# EasyEDA Pro project ProPrj_3x3motors_d_2025-05-30.epro, board PCB1
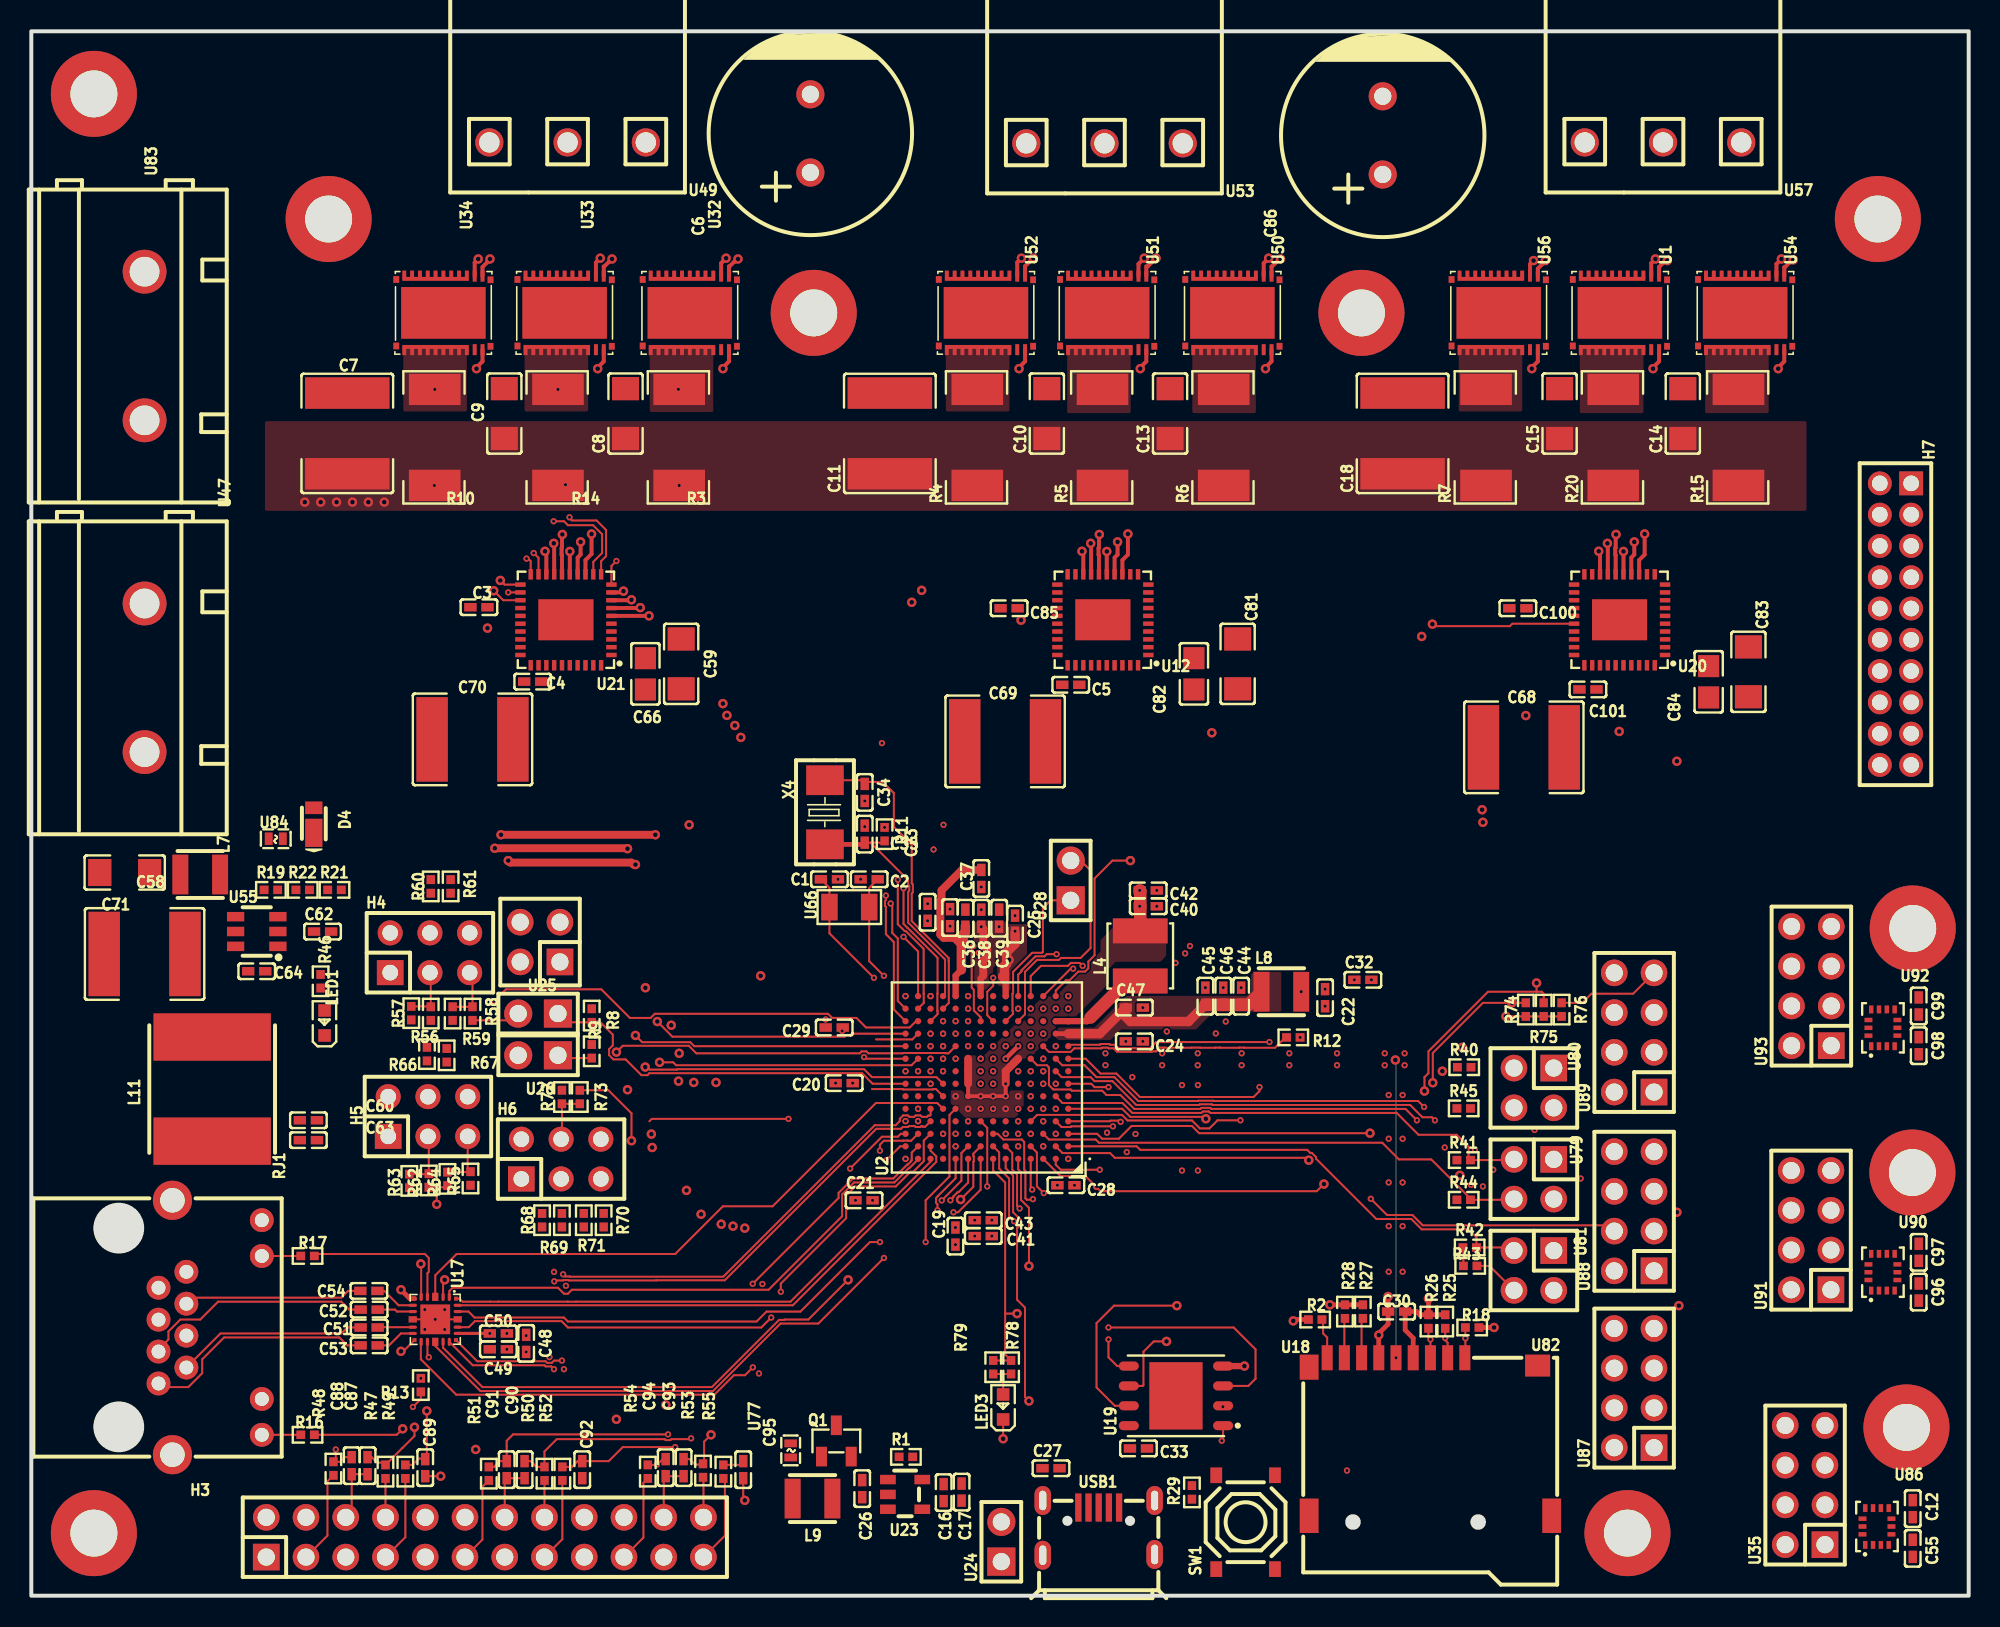
[diagram p4: board, top side]
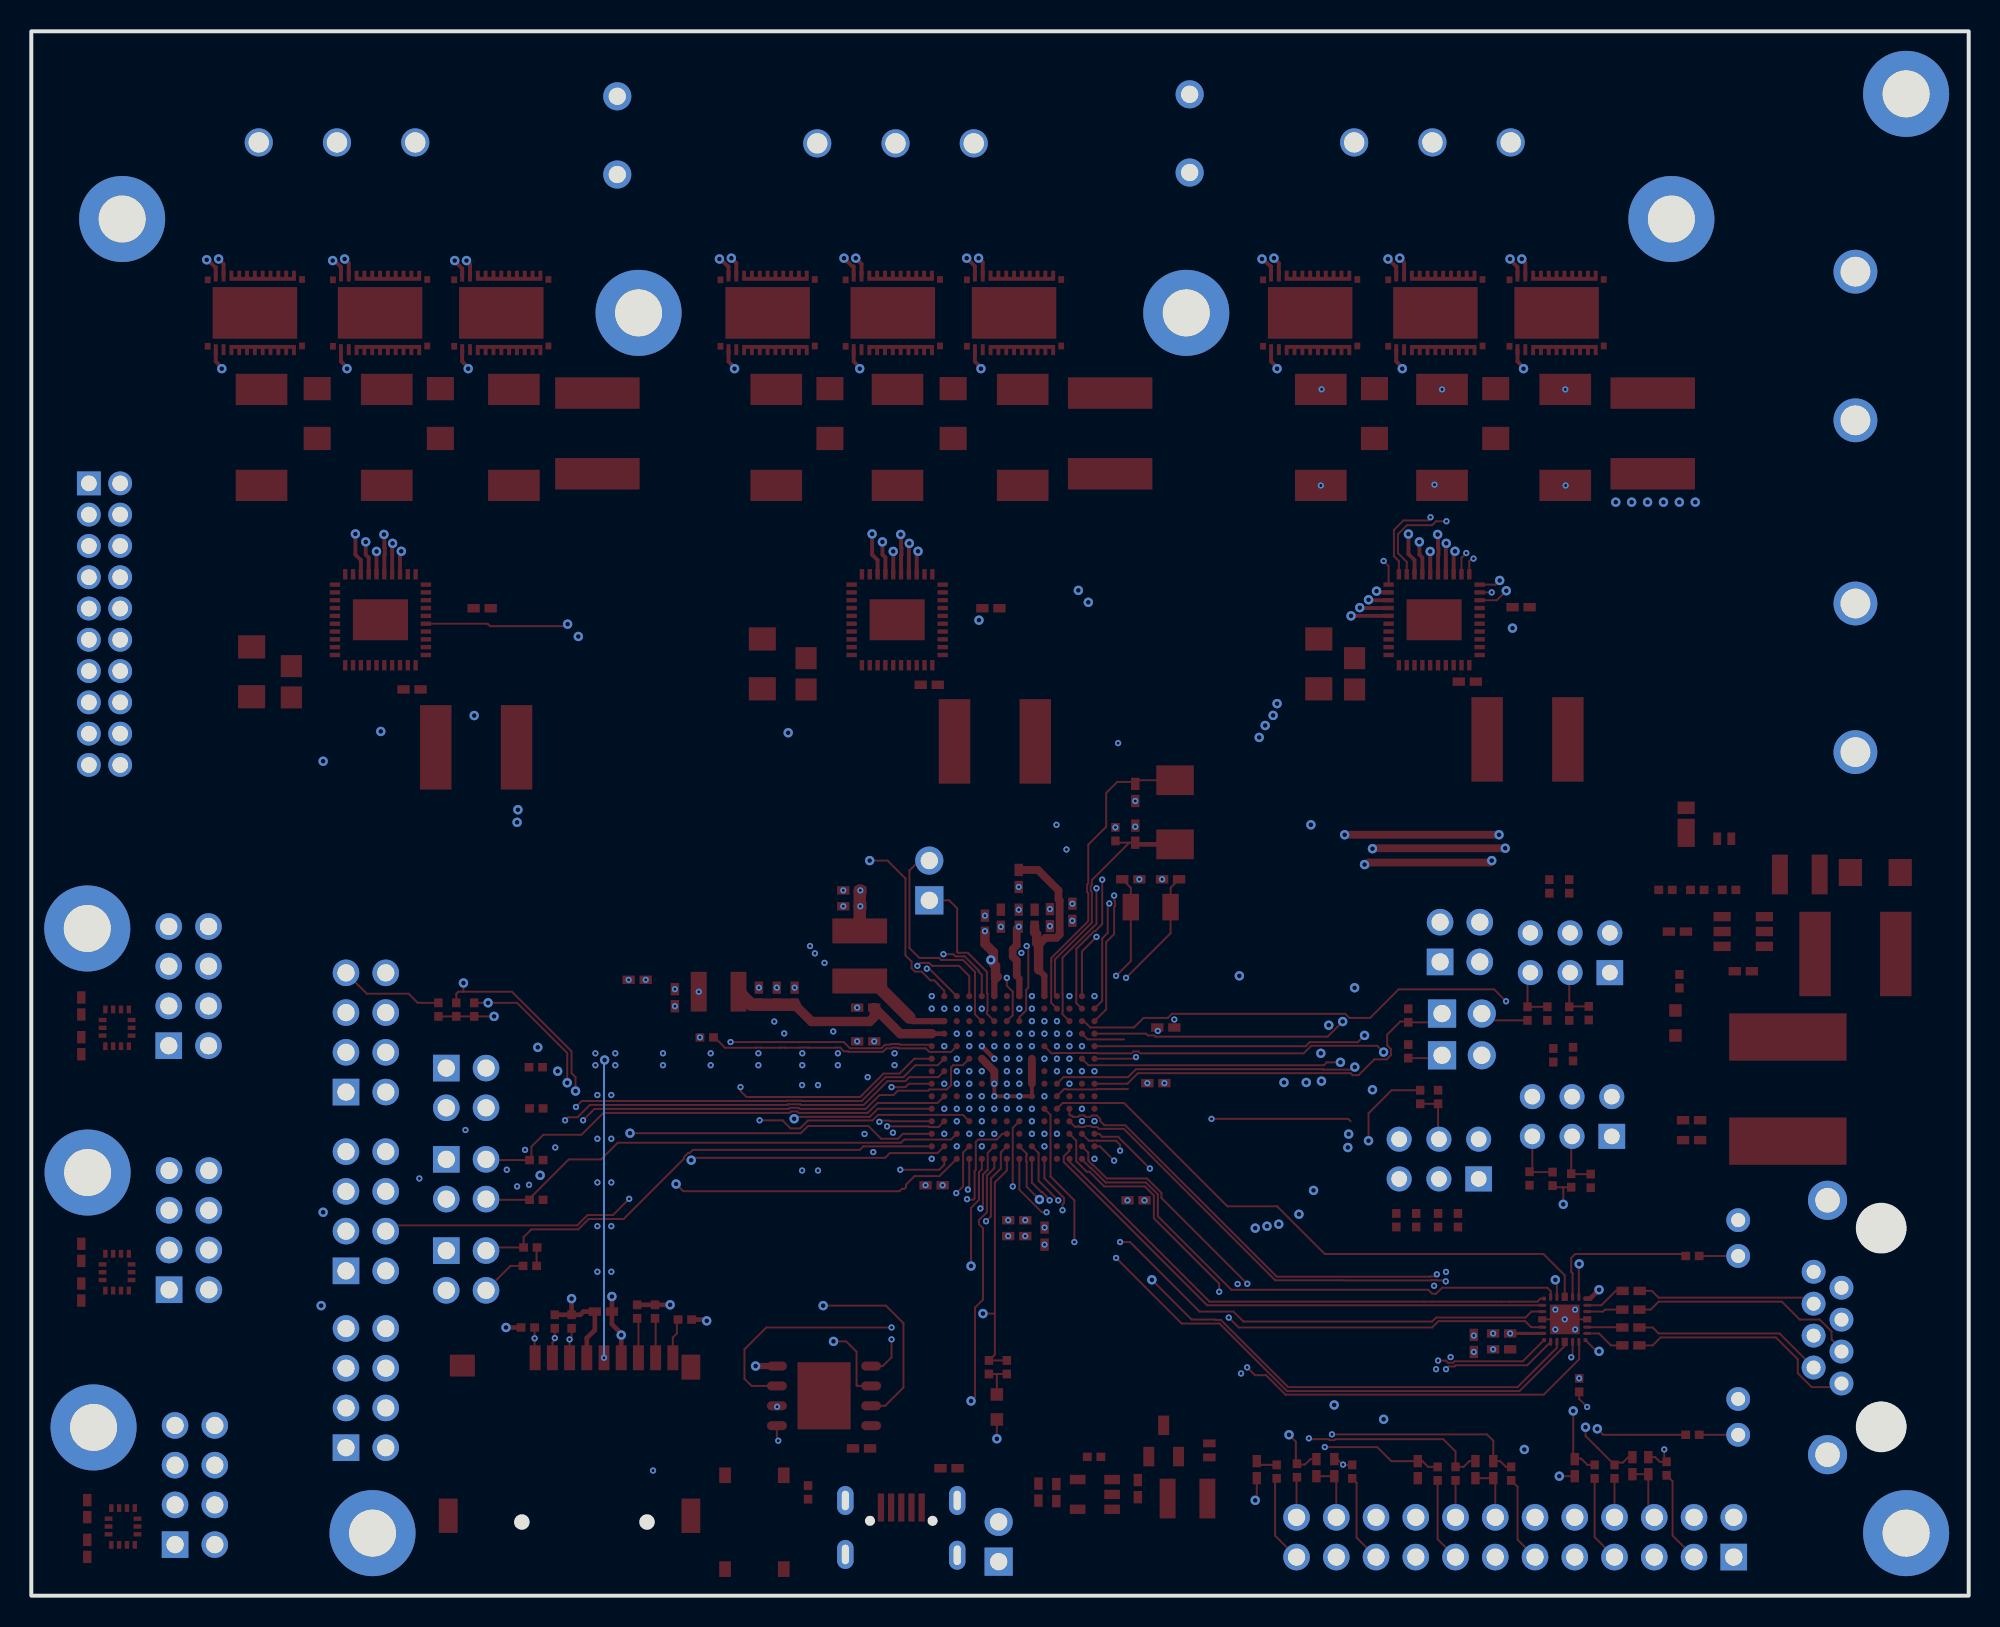
[diagram p5: board, bottom side, seen from below]

Outline 123.81 x 100 mm; copper layers: Top Layer, Inner1, Inner2, Inner3, Inner4, Bottom Layer. Coordinates in mm from the lower left corner of the outline.
Outline path: rectangle 0,100 123.81,0
Stack: Top Layer 0.035mm Outer layer thickness 1oz / Dielectric1 0.0994mm 3313 RC57% 4.2mil / Inner1 0.0152mm Inner layer thickness / Dielectric2 0.55mm 0.55mm H/H No copper / Inner2 0.0152mm Inner layer thickness / Dielectric3 0.1088mm 2116 RC54% 4.9mil / Inner3 0.0152mm Inner layer thickness / Dielectric4 0.55mm 0.55mm H/H No copper / Inner4 0.0152mm Inner layer thickness / Dielectric5 0.0994mm 3313 RC57% 4.2mil / Bottom Layer 0.035mm Outer layer thickness 1oz

## Design rules (mm)
template: Custom Config
spacing copperThickness1oz (default): track to track 0.102, other pairs 0.102 to 0.3
spacing copperThickness2oz: track to track 0.203, other pairs 0.152 to 0.3
track width copperThickness1oz (default): min 0.127, default 0.127, max 2.54
track width copperThickness2oz: min 0.203, default 0.254, max 2.54
differential pair differentialPair (default): width min 0.127, default 0.254, max 2.54; gap min 0.152, default 0.152
via viaSize (default): diameter min 0.4, default 0.6, max 10; hole min 0.2, default 0.3, max 6.3

## Placement (name value [footprint] x y rotation side)
C1  12pF  [C0402]  51 45.79 0 top
C2  12pF  [C0402]  53.54 45.79 180 top
C3  100nF  [C0402]  28.61 63.19 180 top
C4  4.7uF  [C0402]  32.04 58.43 180 top
C5  4.7uF  [C0402]  66.42 58.23 180 top
C6  1000uF  [CAP-TH_BD13.0-P5.00-D0.6-FD]  49.78 93.47 90 top
C7  22uF  [C2220]  20.19 74.3 90 top
C8  1uF  [C1206]  37.97 75.56 90 top
C9  1uF  [C1206]  30.23 75.56 90 top
C10  1uF  [C1206]  64.9 75.56 90 top
C11  22uF  [C2220]  54.86 74.3 90 top
C12  4.7uF  [C0402]  120.23 5.57 90 top
C13  1uF  [C1206]  72.77 75.56 90 top
C14  1uF  [C1206]  105.54 75.56 90 top
C15  1uF  [C1206]  97.66 75.56 90 top
C16  4.7uF  [C0402]  58.3 6.59 90 top
C17  4.7uF  [C0402]  59.45 6.62 90 top
C18  22uF  [C2220]  87.63 74.3 90 top
C19  100nF  [C0402]  59.06 22.99 90 top
C20  100nF  [C0402]  51.94 32.77 0 top
C21  100nF  [C0402]  53.21 25.27 0 top
C22  100nF  [C0402]  82.68 38.23 90 top
C23  100nF  [C0402]  57.28 43.69 270 top
C24  100nF  [C0402]  70.49 35.43 180 top
C25  100nF  [C0402]  62.87 42.93 270 top
C26  100nF  [C0402]  53.1 6.84 90 top
C27  4.7uF  [C0402]  65.16 8.15 0 top
C28  100nF  [C0402]  66.12 26.24 180 top
C29  4.7uF  [C0402]  51.31 36.32 0 top
C30  100nF  [C0402]  87.25 18.16 180 top
C31  100nF  [C0402]  58.71 43.34 270 top
C32  100nF  [C0402]  85.09 39.37 0 top
C33  100nF  [C0402]  70.75 9.42 0 top
C34  12pF  [C0402]  53.26 51.35 270 top
C35  12pF  [C0402]  53.26 48.68 90 top
C36  4.7uF  [C0402]  59.69 43.31 270 top
C37  100nF  [C0402]  60.71 45.85 90 top
C38  4.7uF  [C0402]  60.71 43.31 270 top
C39  100nF  [C0402]  61.85 43.31 270 top
C40  4.7uF  [C0402]  71.37 44.07 0 top
C41  4.7uF  [C0402]  60.83 22.99 0 top
C42  4.7uF  [C0402]  71.37 45.08 0 top
C43  100nF  [C0402]  60.83 24 0 top
C44  4.7uF  [C0402]  77.31 38.32 90 top
C45  4.7uF  [C0402]  75.03 38.32 90 top
C46  4.7uF  [C0402]  76.17 38.32 90 top
C47  100nF  [C0402]  70.49 37.59 0 top
C48  4.7uF  [C0402]  31.62 16.13 90 top
C49  4.7uF  [C0402]  29.84 15.75 0 top
C50  100nF  [C0402]  29.84 16.76 0 top
C51  33nF  [C0402]  21.59 17.15 0 top
C52  33nF  [C0402]  21.59 18.29 0 top
C53  33nF  [C0402]  21.59 16 0 top
C54  33nF  [C0402]  21.57 19.48 0 top
C55  100nF  [C0402]  120.23 3.03 270 top
C58  1uF  [C1206]  5.97 46.23 0 top
C59  1uF  [C1206]  41.53 59.56 90 top
C60  4.7uF  [C0402]  17.71 30.39 0 top
C62  4.7uF  [C0402]  18.61 42.45 0 top
C63  4.7uF  [C0402]  17.71 29.12 0 top
C64  100nF  [C0402]  14.41 39.92 0 top
C66  22nF  [C0805]  39.24 58.93 90 top
C68  22uF  [C2220]  95.38 54.23 180 top
C69  22uF  [C2220]  62.23 54.61 180 top
C70  22uF  [C2220]  28.19 54.74 180 top
C71  22uF  [C2220]  7.24 41.02 0 top
C81  1uF  [C1206]  77.09 59.56 270 top
C82  22nF  [C0805]  74.29 58.93 90 top
C83  1uF  [C1206]  109.73 59.06 270 top
C84  22nF  [C0805]  107.19 58.42 90 top
C85  100nF  [C0402]  62.48 63.12 180 top
C86  1000uF  [CAP-TH_BD13.0-P5.00-D0.6-FD]  86.36 93.34 90 top
C87  4.7nF  [C0402]  21.49 8.31 270 top
C88  4.7nF  [C0402]  20.47 8.31 270 top
C89  4.7nF  [C0402]  25.17 8.18 270 top
C90  4.7nF  [C0402]  31.52 8.06 270 top
C91  4.7nF  [C0402]  30.38 8.06 270 top
C92  4.7nF  [C0402]  35.21 8.06 270 top
C93  4.7nF  [C0402]  41.68 8.18 270 top
C94  4.7nF  [C0402]  40.54 8.18 270 top
C95  4.7nF  [C0402]  45.49 8.06 270 top
C96  100nF  [C0402]  120.61 19.41 270 top
C97  4.7uF  [C0402]  120.61 21.95 90 top
C98  100nF  [C0402]  120.61 35.16 270 top
C99  4.7uF  [C0402]  120.61 37.7 90 top
C100  100nF  [C0402]  95 63.12 180 top
C101  4.7uF  [C0402]  99.47 57.93 180 top
D4  RB160VAM-60TR  [TUMD2M_L2.0-W1.4-LS2.5-RD]  18.05 49.56 90 top
H3  HX PZ2.54-2x12P ZZ  [HDR-TH_24P-P2.54-V-M-R2-C12-S2.54]  28.98 3.74 0 top
H4  排母/2.54mm2x3直排母袋装环保  [HDR-TH_6P-P2.54-V-F-R2-C3-S2.54]  25.47 41.1 0 top
H5  排母/2.54mm2x3直排母袋装环保  [HDR-TH_6P-P2.54-V-F-R2-C3-S2.54]  25.35 30.63 0 top
H6  排母/2.54mm2x3直排母袋装环保  [HDR-TH_6P-P2.54-V-F-R2-C3-S2.54]  33.86 27.91 0 top
H7  2.0-210-SMT-Pin  [HDR-TH_20P-P2.00-V-F-R2-C10-S2.00]  119.13 62.1 270 top
L4  4.7uH  [IND-SMD_L4.0-W4.0]  70.87 40.89 90 top
L7  120nH  [IND-SMD_L2.9-W2.5]  10.8 46.1 180 top
L8  120nH  [IND-SMD_L2.9-W2.5]  79.88 38.61 0 top
L9  120nH  [IND-SMD_L2.9-W2.5]  49.92 6.21 180 top
L11  33uH  [IND-SMD_L8.0-W8.0]  11.56 32.39 90 top
LED1  KT-0603R  [LED0603-RD]  18.74 36.61 90 top
LED3  KT-0603R  [LED0603-RD]  62.1 12.06 90 top
NOREF  -  [Pad_e32]  19 88 0 top
NOREF#2  -  [Pad_e238]  4 96 0 top
NOREF#3  -  [Pad_e94]  118 88 0 top
NOREF#4  -  [Pad_e323]  119.83 10.76 90 top
NOREF#5  -  [Pad_e39]  50 82 0 top
NOREF#6  -  [Pad_e93]  85 82 0 top
NOREF#7  -  [Pad_e242]  4 4 0 top
NOREF#8  -  [Pad_e320]  120.23 42.65 90 top
NOREF#9  -  [Pad_e321]  120.21 27.05 90 top
NOREF#10  -  [Pad_e240]  102 4 0 top
Q1  DMG2305UX-7  [SOT-23-3_L2.9-W1.3-P1.90-LS2.4-BR]  51.44 9.89 270 top
R1  100kΩ  [R0402]  55.89 8.88 0 top
R2  100kΩ  [R0402]  82.04 17.65 180 top
R3  20mΩ  [RES-SMD_L6.4-W3.2-R2512]  41.4 74.04 90 top
R4  20mΩ  [RES-SMD_L6.4-W3.2-R2512]  60.45 74.04 90 top
R5  20mΩ  [RES-SMD_L6.4-W3.2-R2512]  68.45 74.04 90 top
R6  20mΩ  [RES-SMD_L6.4-W3.2-R2512]  76.2 74.04 90 top
R7  20mΩ  [RES-SMD_L6.4-W3.2-R2512]  92.96 74.04 90 top
R8  47kΩ  [R0402]  35.81 37.08 90 top
R9  47kΩ  [R0402]  35.81 34.8 270 top
R10  20mΩ  [RES-SMD_L6.4-W3.2-R2512]  25.78 74.04 90 top
R11  2.2MΩ  [R0402]  54.53 48.68 90 top
R12  1kΩ  [R0402]  80.65 35.69 180 top
R13  6.49kΩ  [R0402]  24.89 13.46 90 top
R14  20mΩ  [RES-SMD_L6.4-W3.2-R2512]  33.66 74.04 90 top
R15  20mΩ  [RES-SMD_L6.4-W3.2-R2512]  109.09 74.04 90 top
R16  150Ω  [R0402]  17.65 10.29 0 top
R17  150Ω  [R0402]  17.65 21.72 0 top
R18  47kΩ  [R0402]  92.07 17.15 0 top
R19  20kΩ  [R0402]  15.31 45.12 0 top
R20  20mΩ  [RES-SMD_L6.4-W3.2-R2512]  101.09 74.04 90 top
R21  100kΩ  [R0402]  19.38 45.12 0 top
R22  4.7kΩ  [R0402]  17.34 45.12 0 top
R25  47kΩ  [R0402]  90.35 17.53 90 top
R26  47kΩ  [R0402]  89.28 17.53 90 top
R27  47kΩ  [R0402]  85.09 18.16 90 top
R28  47kΩ  [R0402]  83.95 18.16 90 top
R29  47kΩ  [R0402]  74.17 6.6 90 top
R40  1kΩ  [R0402]  91.57 33.78 0 top
R41  1kΩ  [R0402]  91.53 27.85 0 top
R42  1kΩ  [R0402]  91.91 22.26 0 top
R43  1kΩ  [R0402]  91.95 21.08 0 top
R44  1kΩ  [R0402]  91.53 25.31 0 top
R45  1kΩ  [R0402]  91.53 31.15 0 top
R46  1kΩ  [R0402]  18.49 39.28 270 top
R47  4.7kΩ  [R0402]  22.63 7.93 270 top
R48  4.7kΩ  [R0402]  19.3 8.13 270 top
R49  4.7kΩ  [R0402]  23.9 7.93 270 top
R50  4.7kΩ  [R0402]  32.79 7.8 270 top
R51  4.7kΩ  [R0402]  29.24 7.8 270 top
R52  4.7kΩ  [R0402]  33.94 7.8 270 top
R53  4.7kΩ  [R0402]  42.93 8 270 top
R54  4.7kΩ  [R0402]  39.4 7.93 270 top
R55  4.7kΩ  [R0402]  44.22 7.93 270 top
R56  4.7kΩ  [R0402]  25.53 37.21 270 top
R57  1kΩ  [R0402]  24.28 37.24 90 top
R58  4.7kΩ  [R0402]  28.19 37.21 270 top
R59  1kΩ  [R0402]  26.92 37.21 90 top
R60  4.7kΩ  [R0402]  25.53 45.34 90 top
R61  1kΩ  [R0402]  26.8 45.34 270 top
R62  4.7kΩ  [R0402]  25.4 26.54 270 top
R63  1kΩ  [R0402]  24.16 26.52 90 top
R64  4.7kΩ  [R0402]  26.59 26.65 270 top
R65  1kΩ  [R0402]  28.07 26.67 90 top
R66  4.7kΩ  [R0402]  25.28 34.62 90 top
R67  1kΩ  [R0402]  26.54 34.54 270 top
R68  4.7kΩ  [R0402]  32.64 24 270 top
R69  1kΩ  [R0402]  33.91 24 90 top
R70  4.7kΩ  [R0402]  36.58 24 270 top
R71  1kΩ  [R0402]  35.31 24 90 top
R72  4.7kΩ  [R0402]  33.91 31.88 90 top
R73  1kΩ  [R0402]  35.05 31.88 270 top
R74  4.7kΩ  [R0402]  95.5 37.47 90 top
R75  4.7kΩ  [R0402]  96.65 37.47 90 top
R76  4.7kΩ  [R0402]  97.79 37.47 90 top
R78  1kΩ  [R0402]  62.61 14.6 270 top
R79  1kΩ  [R0402]  61.47 14.6 270 top
RJ1  RJHSE5384  [RJ45-TH_RJHSE5384]  11.43 17.15 270 top
SW1  TS-1187A-B-A-B  [SW-SMD_4P-L5.1-W5.1-P3.70-LS6.5-TL_H1.5]  77.6 4.7 90 top
U1  CSD88599Q5DC  [SON-22_L5.0-W6.0-P0.50-CSD88599Q5DCT]  101.52 82 270 top
U2  MIMXRT1062DVJ6B  [LFBGA-196_L12.0-W12.0-R14-C14-P0.80-BL]  61.06 33.13 90 top
U12  DRV8304SRHAR  [VQFN-40_L6.0-W6.0-P0.50-TL-EP]  68.47 62.38 180 top
U17  DP83825IRMQR  [HVQFN-24_L3.0-W3.0-P0.40-TL-EP1.9]  25.81 17.66 270 top
U18  A-MicroTF-1.85A  [TF-SMD_A-MICROTF-1.85A]  89.41 10.16 0 top
U19  W25Q64JVZPIQ  [WSON-8_L6.0-W5.0-P1.27-BL-EP]  73.15 12.78 90 top
U20  DRV8304SRHAR  [VQFN-40_L6.0-W6.0-P0.50-TL-EP]  101.5 62.38 180 top
U21  DRV8304SRHAR  [VQFN-40_L6.0-W6.0-P0.50-TL-EP]  34.16 62.38 180 top
U23  TLV75733PDBVR  [SOT-23-5_L2.9-W1.6-P0.95-LS2.8-BL]  55.84 6.47 270 top
U24  USB-5V-supply  [HDR-TH_2P-P2.54-V-M-1]  61.99 3.45 90 top
U25  BOOT_MODE0  [HDR-TH_2P-P2.54-V-M-1]  32.39 37.21 180 top
U26  BOOT_MODE1  [HDR-TH_2P-P2.54-V-M-1]  32.39 34.54 180 top
U28  Spare  [HDR-TH_2P-P2.54-V-M-1]  66.42 45.72 90 top
U32  CSD88599Q5DC  [SON-22_L5.0-W6.0-P0.50-CSD88599Q5DCT]  42.08 82 270 top
U33  CSD88599Q5DC  [SON-22_L5.0-W6.0-P0.50-CSD88599Q5DCT]  34.08 82 270 top
U34  CSD88599Q5DC  [SON-22_L5.0-W6.0-P0.50-CSD88599Q5DCT]  26.33 82 270 top
U35  PZ2.54-2*4  [HDR-TH_8P-P2.54-V-M-R2-C4-S2.54]  113.35 7.07 90 top
U47  MX950T-9.5-02P-GN01-Cu-PS-A  [CONN-TH_2P-P9.50_DB910-9.52-2P]  7.24 58.67 270 top
U49  KF332K-5.0-3P  [CONN-TH_KF332K-5.0-3P]  34.27 92.9 180 top
U50  CSD88599Q5DC  [SON-22_L5.0-W6.0-P0.50-CSD88599Q5DCT]  76.75 82 270 top
U51  CSD88599Q5DC  [SON-22_L5.0-W6.0-P0.50-CSD88599Q5DCT]  68.75 82 270 top
U52  CSD88599Q5DC  [SON-22_L5.0-W6.0-P0.50-CSD88599Q5DCT]  61 82 270 top
U53  KF332K-5.0-3P  [CONN-TH_KF332K-5.0-3P]  68.58 92.84 180 top
U54  CSD88599Q5DC  [SON-22_L5.0-W6.0-P0.50-CSD88599Q5DCT]  109.52 82 270 top
U55  LMR51606XDBVR  [SOT-23-6_L2.9-W1.6-P0.95-LS2.8-BR]  14.41 42.46 0 top
U56  CSD88599Q5DC  [SON-22_L5.0-W6.0-P0.50-CSD88599Q5DCT]  93.77 82 270 top
U57  KF332K-5.0-3P  [CONN-TH_KF332K-5.0-3P]  104.27 92.9 180 top
U66  32.768kHz  [CRYSTAL-SMD_L3.2-W1.5-2]  52.27 44.02 0 top
U77  0ABA-0500-TN  [F0402]  48.53 9.29 270 top
U79  PZ2.54-2*2  [HDR-TH_4P-P2.54-V-M-R2-C2-S2.54]  96.02 26.62 180 top
U80  PZ2.54-2*2  [HDR-TH_4P-P2.54-V-M-R2-C2-S2.54]  96.02 32.46 180 top
U81  PZ2.54-2*2  [HDR-TH_4P-P2.54-V-M-R2-C2-S2.54]  96.02 20.79 180 top
U82  PZ2.54-2*2  [HDR-TH_4P-P2.54-V-M-R2-C2-S2.54]  32.51 41.78 90 top
U83  MX950T-9.5-02P-GN01-Cu-PS-A  [CONN-TH_2P-P9.50_DB910-9.52-2P]  7.24 79.88 270 top
U84  0ABA-0500-TN  [F0402]  15.62 48.39 180 top
U86  ASM330LHHTR  [LGA-14L_L3.0-W2.5-P0.50-TL]  117.94 4.42 90 top
U87  PZ2.54-2*4  [HDR-TH_8P-P2.54-V-M-R2-C4-S2.54]  102.43 13.27 90 top
U88  PZ2.54-2*4  [HDR-TH_8P-P2.54-V-M-R2-C4-S2.54]  102.43 24.57 90 top
U89  PZ2.54-2*4  [HDR-TH_8P-P2.54-V-M-R2-C4-S2.54]  102.43 36 90 top
U90  ASM330LHHTR  [LGA-14L_L3.0-W2.5-P0.50-TL]  118.32 20.68 90 top
U91  PZ2.54-2*4  [HDR-TH_8P-P2.54-V-M-R2-C4-S2.54]  113.73 23.37 90 top
U92  ASM330LHHTR  [LGA-14L_L3.0-W2.5-P0.50-TL]  118.32 36.3 90 top
U93  PZ2.54-2*4  [HDR-TH_8P-P2.54-V-M-R2-C4-S2.54]  113.75 38.97 90 top
USB1  051N-4BH806-S  [MICRO-USB-SMD_051N-4BH806-S]  68.21 4.34 0 top
X4  24MHz  [OSC-SMD_L5.0-W3.2]  50.72 50.08 270 top

## Footprints (pads in the part's own frame, mm; a bottom-side part is the same pattern mirrored in y, then rotated)
C0402
  rect 0.79x0.54 smd: 1(-0.545,0) 2(0.545,0)
C0805
  rect 1.41x1.35 smd: 1(-1,0) 2(1,0)
C1206
  rect 1.485x1.728 smd: 1(-1.593,0) 2(1.593,0)
C2220
  rect 2.01x5.4 smd: 1(-2.58,0) 2(2.58,0)
CAP-TH_BD13.0-P5.00-D0.6-FD
  round 1.8 hole 1.1: 1(-2.5,0) 2(2.5,0)
CONN-TH_2P-P9.50_DB910-9.52-2P
  round 2.8 hole 1.9: 1(-4.75,0) 2(4.75,0)
CONN-TH_KF332K-5.0-3P
  round 1.8 hole 1.3: 1(-5,0) 2(0,0) 3(5,0)
CRYSTAL-SMD_L3.2-W1.5-2
  rect 1.05x1.7 smd: 1(-1.27,0) 2(1.27,0)
F0402
  rect 0.5x0.8 smd: 1(-0.45,0) 2(0.45,0)
HDR-TH_2P-P2.54-V-M-1
  rect 1.8x1.8 hole 1.1: 1(-1.27,0)
  round 1.8 hole 1.1: 2(1.27,0)
HDR-TH_4P-P2.54-V-M-R2-C2-S2.54
  rect 1.7x1.7 hole 1.1: 1(-1.27,-1.27)
  round 1.7 hole 1.1: 2(-1.27,1.27) 3(1.27,-1.27) 4(1.27,1.27)
HDR-TH_6P-P2.54-V-F-R2-C3-S2.54
  rect 1.7x1.6 hole 1: 1(-2.54,-1.27)
  round 1.6 hole 1: 2(-2.54,1.27) 3(0,-1.27) 4(0,1.27) 5(2.54,-1.27) 6(2.54,1.27)
HDR-TH_8P-P2.54-V-M-R2-C4-S2.54
  rect 1.7x1.7 hole 1.1: 1(-3.81,-1.27)
  round 1.7 hole 1.1: 2(-3.81,1.27) 3(-1.27,-1.27) 4(-1.27,1.27) 5(1.27,-1.27) 6(1.27,1.27) 7(3.81,-1.27) 8(3.81,1.27)
HDR-TH_20P-P2.00-V-F-R2-C10-S2.00
  rect 1.524x1.524 hole 1: 1(-9,1)
  round 1.524 hole 1: 2(-9,-1) 3(-7,1) 4(-7,-1) 5(-5,1) 6(-5,-1) 7(-3,1) 8(-3,-1) 9(-1,1) 10(-1,-1) 11(1,1) 12(1,-1) 13(3,1) 14(3,-1) 15(5,1) 16(5,-1) 17(7,1) 18(7,-1) 19(9,1) 20(9,-1)
HDR-TH_24P-P2.54-V-M-R2-C12-S2.54
  rect 1.7x1.7 hole 1.1: 1(-13.97,-1.27)
  round 1.7 hole 1.1: 2(-13.97,1.27) 3(-11.43,-1.27) 4(-11.43,1.27) 5(-8.89,-1.27) 6(-8.89,1.27) 7(-6.35,-1.27) 8(-6.35,1.27) 9(-3.81,-1.27) 10(-3.81,1.27) 11(-1.27,-1.27) 12(-1.27,1.27) 13(1.27,-1.27) 14(1.27,1.27) 15(3.81,-1.27) 16(3.81,1.27) 17(6.35,-1.27) 18(6.35,1.27) 19(8.89,-1.27) 20(8.89,1.27) 21(11.43,-1.27) 22(11.43,1.27) 23(13.97,-1.27) 24(13.97,1.27)
HVQFN-24_L3.0-W3.0-P0.40-TL-EP1.9
  oval 0.525x0.2 smd: 1(-1.438,0.9) 2(-1.438,0.5) 4(-1.438,-0.5) 5(-1.438,-0.9) 13(1.438,-0.9) 14(1.438,-0.5) 16(1.438,0.5) 17(1.438,0.9)
  rect 0.525x0.4 smd: 3(-1.438,0) 15(1.438,0)
  rect 0.25x0.25 smd: 6(-1.325,-1.325) 12(1.325,-1.325) 18(1.325,1.325) 24(-1.325,1.325)
  oval 0.2x0.525 smd: 7(-0.9,-1.438) 8(-0.5,-1.438) 10(0.5,-1.438) 11(0.9,-1.438) 19(0.9,1.438) 20(0.5,1.438) 22(-0.5,1.438) 23(-0.9,1.438)
  rect 0.4x0.525 smd: 9(0,-1.438) 21(0,1.438)
  rect 1.9x1.9 smd: 25(0,0)
IND-SMD_L2.9-W2.5
  rect 1.02x2.54 smd: 1(-1.27,0) 2(1.27,0)
IND-SMD_L4.0-W4.0
  rect 1.6x3.5 smd: 1(-1.6,0) 2(1.6,0)
IND-SMD_L8.0-W8.0
  rect 3.024x7.5 smd: 1(3.328,0) 2(-3.328,0)
LED0603-RD
  rect 0.8x0.8 smd: 1(-0.799,0) 2(0.799,0)
LFBGA-196_L12.0-W12.0-R14-C14-P0.80-BL
  round 0.4 smd: A1(-5.2,-5.2) A2(-5.2,-4.4) A3(-5.2,-3.6) A4(-5.2,-2.8) A5(-5.2,-2) A6(-5.2,-1.2) A7(-5.2,-0.4) A8(-5.2,0.4) A9(-5.2,1.2) A10(-5.2,2) A11(-5.2,2.8) A12(-5.2,3.6) A13(-5.2,4.4) A14(-5.2,5.2) B1(-4.4,-5.2) B2(-4.4,-4.4) B3(-4.4,-3.6) B4(-4.4,-2.8) B5(-4.4,-2) B6(-4.4,-1.2) B7(-4.4,-0.4) B8(-4.4,0.4) B9(-4.4,1.2) B10(-4.4,2) B11(-4.4,2.8) B12(-4.4,3.6) B13(-4.4,4.4) B14(-4.4,5.2) C1(-3.6,-5.2) C2(-3.6,-4.4) C3(-3.6,-3.6) C4(-3.6,-2.8) C5(-3.6,-2) C6(-3.6,-1.2) C7(-3.6,-0.4) C8(-3.6,0.4) C9(-3.6,1.2) C10(-3.6,2) C11(-3.6,2.8) C12(-3.6,3.6) C13(-3.6,4.4) C14(-3.6,5.2) D1(-2.8,-5.2) D2(-2.8,-4.4) D3(-2.8,-3.6) D4(-2.8,-2.8) D5(-2.8,-2) D6(-2.8,-1.2) D7(-2.8,-0.4) D8(-2.8,0.4) D9(-2.8,1.2) D10(-2.8,2) D11(-2.8,2.8) D12(-2.8,3.6) D13(-2.8,4.4) D14(-2.8,5.2) E1(-2,-5.2) E2(-2,-4.4) E3(-2,-3.6) E4(-2,-2.8) E5(-2,-2) E6(-2,-1.2) E7(-2,-0.4) E8(-2,0.4) E9(-2,1.2) E10(-2,2) E11(-2,2.8) E12(-2,3.6) E13(-2,4.4) E14(-2,5.2) F1(-1.2,-5.2) F2(-1.2,-4.4) F3(-1.2,-3.6) F4(-1.2,-2.8) F5(-1.2,-2) F6(-1.2,-1.2) F7(-1.2,-0.4) F8(-1.2,0.4) F9(-1.2,1.2) F10(-1.2,2) F11(-1.2,2.8) F12(-1.2,3.6) F13(-1.2,4.4) F14(-1.2,5.2) G1(-0.4,-5.2) G2(-0.4,-4.4) G3(-0.4,-3.6) G4(-0.4,-2.8) G5(-0.4,-2) G6(-0.4,-1.2) G7(-0.4,-0.4) G8(-0.4,0.4) G9(-0.4,1.2) G10(-0.4,2) G11(-0.4,2.8) G12(-0.4,3.6) G13(-0.4,4.4) G14(-0.4,5.2) H1(0.4,-5.2) H2(0.4,-4.4) H3(0.4,-3.6) H4(0.4,-2.8) H5(0.4,-2) H6(0.4,-1.2) H7(0.4,-0.4) H8(0.4,0.4) H9(0.4,1.2) H10(0.4,2) H11(0.4,2.8) H12(0.4,3.6) H13(0.4,4.4) H14(0.4,5.2) J1(1.2,-5.2) J2(1.2,-4.4) J3(1.2,-3.6) J4(1.2,-2.8) J5(1.2,-2) J6(1.2,-1.2) J7(1.2,-0.4) J8(1.2,0.4) J9(1.2,1.2) J10(1.2,2) J11(1.2,2.8) J12(1.2,3.6) J13(1.2,4.4) J14(1.2,5.2) K1(2,-5.2) K2(2,-4.4) K3(2,-3.6) K4(2,-2.8) K5(2,-2) K6(2,-1.2) K7(2,-0.4) K8(2,0.4) K9(2,1.2) K10(2,2) K11(2,2.8) K12(2,3.6) K13(2,4.4) K14(2,5.2) L1(2.8,-5.2) L2(2.8,-4.4) L3(2.8,-3.6) L4(2.8,-2.8) L5(2.8,-2) L6(2.8,-1.2) L7(2.8,-0.4) L8(2.8,0.4) L9(2.8,1.2) L10(2.8,2) L11(2.8,2.8) L12(2.8,3.6) L13(2.8,4.4) L14(2.8,5.2) M1(3.6,-5.2) M2(3.6,-4.4) M3(3.6,-3.6) M4(3.6,-2.8) M5(3.6,-2) M6(3.6,-1.2) M7(3.6,-0.4) M8(3.6,0.4) M9(3.6,1.2) M10(3.6,2) M11(3.6,2.8) M12(3.6,3.6) M13(3.6,4.4) M14(3.6,5.2) N1(4.4,-5.2) N2(4.4,-4.4) N3(4.4,-3.6) N4(4.4,-2.8) N5(4.4,-2) N6(4.4,-1.2) N7(4.4,-0.4) N8(4.4,0.4) N9(4.4,1.2) N10(4.4,2) N11(4.4,2.8) N12(4.4,3.6) N13(4.4,4.4) N14(4.4,5.2) P1(5.2,-5.2) P2(5.2,-4.4) P3(5.2,-3.6) P4(5.2,-2.8) P5(5.2,-2) P6(5.2,-1.2) P7(5.2,-0.4) P8(5.2,0.4) P9(5.2,1.2) P10(5.2,2) P11(5.2,2.8) P12(5.2,3.6) P13(5.2,4.4) P14(5.2,5.2)
LGA-14L_L3.0-W2.5-P0.50-TL
  rect 0.5x0.28 smd: 1(-1.175,0.75) 2(-1.175,0.25) 3(-1.175,-0.25) 4(-1.175,-0.75) 8(1.175,-0.75) 9(1.175,-0.25) 10(1.175,0.25) 11(1.175,0.75)
  rect 0.28x0.5 smd: 5(-0.5,-0.925) 6(0,-0.925) 7(0.5,-0.925) 12(0.5,0.925) 13(0,0.925) 14(-0.5,0.925)
MICRO-USB-SMD_051N-4BH806-S
  rect 0.4x1.8 smd: 1(-1.3,1.3) 2(-0.65,1.3) 3(0,1.3) 4(0.65,1.3) 5(1.3,1.3)
  oval 1.05x1.85 hole 0.45x1.25: 6(-3.575,1.75) 7(-3.575,-1.75) 8(3.575,1.75) 9(3.575,-1.7)
OSC-SMD_L5.0-W3.2
  rect 1.9x2.4 smd: 1(-2.05,0) 2(2.05,0)
Pad_e32
  round 5.5 hole 3: 1(0,0)
Pad_e39
  round 5.5 hole 3: 1(0,0)
Pad_e93
  round 5.5 hole 3: 1(0,0)
Pad_e94
  round 5.5 hole 3: 1(0,0)
Pad_e238
  round 5.5 hole 3: 1(0,0)
Pad_e240
  round 5.5 hole 3: 1(0,0)
Pad_e242
  round 5.5 hole 3: 1(0,0)
Pad_e320
  round 5.5 hole 3: 1(0,0)
Pad_e321
  round 5.5 hole 3: 1(0,0)
Pad_e323
  round 5.5 hole 3: 1(0,0)
R0402
  rect 0.566x0.54 smd: 1(-0.433,0) 2(0.433,0)
RES-SMD_L6.4-W3.2-R2512
  rect 2x3.3 smd: 1(-3.067,0) 2(3.067,0)
RJ45-TH_RJHSE5384
  round 1.524 hole 0.89: 1(3.58,-3.3) 2(2.56,-1.52) 3(1.54,-3.3) 4(0.52,-1.52) 5(-0.5,-3.3) 6(-1.52,-1.52) 7(-2.54,-3.3) 8(-3.56,-1.52) 9(6.86,3.3) 10(4.57,3.3) 11(-4.57,3.3) 12(-6.86,3.3)
  round 2.5 hole 1.57: 13(-8.13,-2.41) 14(8.13,-2.41)
SON-22_L5.0-W6.0-P0.50-CSD88599Q5DCT
  rect 0.7x0.25 smd: 1(-2.35,2.5) 2(-2.35,2) 21(2.35,2) 22(2.35,2.5)
  rect 0.45x0.25 smd: 3(-2.475,1.5) 4(-2.475,1) 5(-2.475,0.5) 6(-2.475,0) 7(-2.475,-0.5) 8(-2.475,-1) 9(-2.475,-1.5) 10(-2.475,-2) 11(-2.475,-2.5) 12(2.475,-2.5) 13(2.475,-2) 14(2.475,-1.5) 15(2.475,-1) 16(2.475,-0.5) 17(2.475,0) 18(2.475,0.5) 19(2.475,1) 20(2.475,1.5)
  rect 0.25x4.25 smd: 11(-2.175,-0.5) 20(2.175,-0.5)
  rect 0.43x0.375 smd: 23(-2.115,3.013) 24(-2.135,-3.013) 25(2.115,-3.013) 26(2.135,3.013)
  rect 3.3x5.4 smd: 27(0,0)
SOT-23-3_L2.9-W1.3-P1.90-LS2.4-BR
  rect 1.25x0.7 smd: 1(1,-0.95) 2(1,0.95) 3(-1,0)
SOT-23-5_L2.9-W1.6-P0.95-LS2.8-BL
  rect 0.6x1 smd: 1(-0.95,-1.1) 2(0,-1.1) 3(0.95,-1.1) 4(0.95,1.1) 5(-0.95,1.1)
SOT-23-6_L2.9-W1.6-P0.95-LS2.8-BR
  rect 1.1x0.6 smd: 1(1.35,-0.95) 2(1.35,0) 3(1.35,0.95) 4(-1.35,0.95) 5(-1.35,0) 6(-1.35,-0.95)
SW-SMD_4P-L5.1-W5.1-P3.70-LS6.5-TL_H1.5
  rect 1x0.75 smd: 1(-3,1.875) 2(3,1.875) 3(-3,-1.875) 4(3,-1.875)
TF-SMD_A-MICROTF-1.85A
  rect 0.7x1.6 smd: 1(2.2,5.05) 2(1.1,5.05) 3(0,5.05) 4(-1.1,5.05) 5(-2.2,5.05) 6(-3.3,5.05) 7(-4.4,5.05) 8(-5.5,5.05) 9(-6.6,5.05)
  rect 1.2x1.6 smd: 10(-7.75,4.45)
  rect 1.2x2.2 smd: 10(-7.75,-5.05) 10(7.75,-5.05)
  rect 1.6x1.4 smd: 10(6.85,4.55)
TUMD2M_L2.0-W1.4-LS2.5-RD
  rect 1.8x1.1 smd: 1(-0.8,0)
  rect 0.8x1.1 smd: 2(0.8,0)
VQFN-40_L6.0-W6.0-P0.50-TL-EP
  rect 0.665x0.28 smd: 1(-2.908,2.25) 2(-2.908,1.75) 3(-2.908,1.25) 4(-2.908,0.75) 5(-2.908,0.25) 6(-2.908,-0.25) 7(-2.908,-0.75) 8(-2.908,-1.25) 9(-2.908,-1.75) 10(-2.908,-2.25) 21(2.908,-2.25) 22(2.908,-1.75) 23(2.908,-1.25) 24(2.908,-0.75) 25(2.908,-0.25) 26(2.908,0.25) 27(2.908,0.75) 28(2.908,1.25) 29(2.908,1.75) 30(2.908,2.25)
  rect 0.28x0.665 smd: 11(-2.25,-2.908) 12(-1.75,-2.908) 13(-1.25,-2.908) 14(-0.75,-2.908) 15(-0.25,-2.908) 16(0.25,-2.908) 17(0.75,-2.908) 18(1.25,-2.908) 19(1.75,-2.908) 20(2.25,-2.908) 31(2.25,2.908) 32(1.75,2.908) 33(1.25,2.908) 34(0.75,2.908) 35(0.25,2.908) 36(-0.25,2.908) 37(-0.75,2.908) 38(-1.25,2.908) 39(-1.75,2.908) 40(-2.25,2.908)
  rect 3.52x2.62 smd: 41(0,0)
WSON-8_L6.0-W5.0-P1.27-BL-EP
  oval 0.581x1.276 smd: 1(-1.905,-3.013) 2(-0.635,-3.013) 3(0.635,-3.013) 4(1.905,-3.013) 5(1.905,3.013) 6(0.635,3.013) 7(-0.635,3.013) 8(-1.905,3.013)
  rect 4.3x3.4 smd: 9(0,0)

## Nets
3.3V: C16.2 C17.2 C19.2 C20.2 C21.2 C22.2 C23.2 C24.2 C28.2 C30.1 C33.1 C48.1 C49.1 C50.1 H3.2 H3.4 H3.10 H3.18 H7.2 L8.2 R1.2 R2.2 R18.2 R25.2 R26.2 R27.2 R28.2 R40.1 R41.1 R42.1 R43.1 R44.1 R45.1 R56.2 R58.2 R60.2 R62.2 R64.2 R66.2 R68.2 R70.2 R72.2 R74.1 R75.1 R76.1 RJ1.10 RJ1.12 SW1.4 U2.E6 U2.E9 U2.F5 U2.F10 U2.J6 U2.J10 U2.K4 U2.K5 U2.M9 U2.P12 U17.6 U17.19 U18.4 U19.8 U23.5 U25.2 U26.2 U82.1 U87.1 U88.1 U89.1
3.3V-1: C12.2 C55.2 U35.1 U86.2 U86.3 U86.5 U86.8
3.3V-2: C96.2 C97.2 U90.2 U90.3 U90.5 U90.8 U91.1
3.3V-3: C98.2 C99.2 U92.2 U92.3 U92.5 U92.8 U93.1
5.0V: C25.2 C26.2 C60.1 C62.1 C63.1 H4.1 H5.1 H6.1 L11.2 Q1.2 R21.2 R46.1 U2.P6 U23.1 U79.2 U80.2 U81.2
36V: C6.1 C7.2 C8.2 C9.2 C10.2 C11.2 C13.2 C14.2 C15.2 C18.2 C59.2 C68.1 C69.1 C70.1 C81.2 C83.2 C86.1 U1.27 U12.4 U12.5 U20.4 U20.5 U21.4 U21.5 U32.27 U33.27 U34.27 U50.27 U51.27 U52.27 U54.27 U56.27 U83.1
GND: C1.2 C2.2 C3.2 C4.2 C5.2 C6.2 C7.1 C8.1 C9.1 C10.1 C11.1 C13.1 C14.1 C15.1 C16.1 C17.1 C18.1 C19.1 C20.1 C21.1 C22.1 C23.1 C24.1 C25.1 C26.1 C27.1 C28.1 C29.1 C30.2 C31.1 C32.2 C33.2 C34.2 C35.2 C36.1 C37.1 C38.1 C39.1 C40.2 C41.2 C42.2 C43.2 C44.2 C45.2 C46.2 C47.2 C48.2 C49.2 C50.2 C58.1 C60.2 C62.2 C63.2 C68.2 C69.2 C70.2 C71.1 C85.2 C86.2 C87.2 C88.2 C89.2 C90.2 C91.2 C92.2 C93.2 C94.2 C95.2 C100.2 C101.2 H3.1 H3.5 H3.6 H3.14 H3.22 H4.2 H5.2 H6.2 H7.3 H7.4 H7.5 LED1.1 LED3.1 NOREF.1 NOREF#2.1 NOREF#3.1 NOREF#5.1 NOREF#6.1 NOREF#7.1 NOREF#10.1 Q1.1 R3.1 R4.1 R5.1 R6.1 R7.1 R8.2 R9.1 R10.1 R11.2 R12.1 R13.1 R14.1 R15.1 R19.1 R20.1 R29.1 RJ1.13 RJ1.14 U2.A1 U2.A14 U2.B5 U2.B10 U2.E2 U2.E13 U2.G7 U2.G8 U2.H7 U2.H8 U2.J7 U2.J8 U2.K2 U2.K6 U2.K9 U2.K13 U2.L9 U2.N1 U2.N2 U2.N5 U2.N8 U2.P1 U2.P14 U12.10 U12.11 U12.20 U12.32 U12.40 U12.41 U17.9 U17.21 U17.25 U18.6 U18.10 U19.4 U20.10 U20.11 U20.20 U20.32 U20.40 U20.41 U21.10 U21.11 U21.20 U21.32 U21.40 U21.41 U47.2 U55.2 U79.1 U80.1 U81.1 U82.3 U87.2 U88.2 U89.2 USB1.5 USB1.6 USB1.7 USB1.8 USB1.9
GND-1: C12.1 C55.1 U35.2 U86.6 U86.7
GND-2: C96.1 C97.1 U90.6 U90.7 U91.2
GND-3: C98.1 C99.1 U92.6 U92.7 U93.2
VDD_SOC_IN: C40.1 C41.1 C42.1 C43.1 L4.2 U2.F6 U2.F7 U2.F8 U2.F9 U2.G6 U2.G9 U2.H6 U2.H9 U2.J5 U2.J9
VDDA_ADC_3P3: H7.16 U2.N14
$1I69294\A1-VCO: H3.3 R48.2
$1I69294\A1-VSI: H3.7 R49.2
$1I69294\A1-VTEM: H3.8 R47.2
$1I69294\A2-VCO: H3.11 R51.2
$1I69294\A2-VSI: H3.15 R52.2
$1I69294\A2-VTEM: H3.16 R50.2
$1I69294\A3-VCO: H3.19 R54.2
$1I69294\A3-VSI: H3.23 R55.2
$1I69294\A3-VTEM: H3.24 R53.2
$1I69294\G-CS-1: U35.4 U86.12
$1I69294\G-CS-2: U90.12 U91.4
$1I69294\G-CS-3: U92.12 U93.4
$1I69294\MISO-SDO-1: U35.3 U86.1
$1I69294\MISO-SDO-2: U90.1 U91.3
$1I69294\MISO-SDO-3: U92.1 U93.3
$1I69294\MOSI-SDI-1: U35.5 U86.14
$1I69294\MOSI-SDI-2: U90.14 U91.5
$1I69294\MOSI-SDI-3: U92.14 U93.5
$1I69294\SCLK-1: U35.7 U86.13
$1I69294\SCLK-2: U90.13 U91.7
$1I69294\SCLK-3: U92.13 U93.7
$1I78243\$1N2148: C84.2 U20.2
$1I78243\$1N2149: C83.1 U20.3
$1I78243\$1N2150: C84.1 U20.1
$1I78243\$1N2153: C81.1 U12.3
$1I78243\$1N2154: C82.2 U12.2
$1I78243\$1N2155: C82.1 U12.1
$1I78243\$1N2170: C59.1 U21.3
$1I78243\$1N2171: C66.1 U21.1
$1I78243\$1N2172: C66.2 U21.2
$1I78243\$1N6352: C3.1 U21.24
$1I78243\$1N6618: C4.1 U21.33
$1I78243\$1N6708: C5.1 U12.33
$1I78243\$1N6714: C85.1 U12.24
$1I78243\$1N9886: U32.3 U32.4 U32.5 U32.6 U32.7 U32.8 U32.9 U32.10 U32.11 U49.1
$1I78243\$1N10035: U33.3 U33.4 U33.5 U33.6 U33.7 U33.8 U33.9 U33.10 U33.11 U49.2
$1I78243\$1N10055: U34.3 U34.4 U34.5 U34.6 U34.7 U34.8 U34.9 U34.10 U34.11 U49.3
$1I78243\$1N10902: U50.3 U50.4 U50.5 U50.6 U50.7 U50.8 U50.9 U50.10 U50.11 U53.1
$1I78243\$1N10928: U52.3 U52.4 U52.5 U52.6 U52.7 U52.8 U52.9 U52.10 U52.11 U53.3
$1I78243\$1N10963: U51.3 U51.4 U51.5 U51.6 U51.7 U51.8 U51.9 U51.10 U51.11 U53.2
$1I78243\$1N15383: U56.3 U56.4 U56.5 U56.6 U56.7 U56.8 U56.9 U56.10 U56.11 U57.3
$1I78243\$1N15409: U1.3 U1.4 U1.5 U1.6 U1.7 U1.8 U1.9 U1.10 U1.11 U57.2
$1I78243\$1N15447: U54.3 U54.4 U54.5 U54.6 U54.7 U54.8 U54.9 U54.10 U54.11 U57.1
$1I78243\$1N15620: C100.1 U20.24
$1I78243\$1N15622: C101.1 U20.33
$1I78243\M1-GHA: U21.6 U32.1
$1I78243\M1-GHB: U21.15 U33.1
$1I78243\M1-GHC: U21.16 U34.1
$1I78243\M1-GLA: U21.8 U32.22
$1I78243\M1-GLB: U21.13 U33.22
$1I78243\M1-GLC: U21.18 U34.22
$1I78243\M1-SHA: U21.7 U32.2
$1I78243\M1-SHB: U21.14 U33.2
$1I78243\M1-SHC: U21.17 U34.2
$1I78243\M1-SPA: R3.2 U21.9 U32.12 U32.13 U32.14 U32.15 U32.16 U32.17 U32.18 U32.19 U32.20
$1I78243\M1-SPB: R14.2 U21.12 U33.12 U33.13 U33.14 U33.15 U33.16 U33.17 U33.18 U33.19 U33.20
$1I78243\M1-SPC: R10.2 U21.19 U34.12 U34.13 U34.14 U34.15 U34.16 U34.17 U34.18 U34.19 U34.20
$1I78243\M2-GHA: U12.6 U50.1
$1I78243\M2-GHB: U12.15 U51.1
$1I78243\M2-GHC: U12.16 U52.1
$1I78243\M2-GLA: U12.8 U50.22
$1I78243\M2-GLB: U12.13 U51.22
$1I78243\M2-GLC: U12.18 U52.22
$1I78243\M2-SHA: U12.7 U50.2
$1I78243\M2-SHB: U12.14 U51.2
$1I78243\M2-SHC: U12.17 U52.2
$1I78243\M2-SPA: R6.2 U12.9 U50.12 U50.13 U50.14 U50.15 U50.16 U50.17 U50.18 U50.19 U50.20
$1I78243\M2-SPB: R5.2 U12.12 U51.12 U51.13 U51.14 U51.15 U51.16 U51.17 U51.18 U51.19 U51.20
$1I78243\M2-SPC: R4.2 U12.19 U52.12 U52.13 U52.14 U52.15 U52.16 U52.17 U52.18 U52.19 U52.20
$1I78243\M3-GHA: U20.6 U54.1
$1I78243\M3-GHB: U1.1 U20.15
$1I78243\M3-GHC: U20.16 U56.1
$1I78243\M3-GLA: U20.8 U54.22
$1I78243\M3-GLB: U1.22 U20.13
$1I78243\M3-GLC: U20.18 U56.22
$1I78243\M3-SHA: U20.7 U54.2
$1I78243\M3-SHB: U1.2 U20.14
$1I78243\M3-SHC: U20.17 U56.2
$1I78243\M3-SPA: R15.2 U20.9 U54.12 U54.13 U54.14 U54.15 U54.16 U54.17 U54.18 U54.19 U54.20
$1I78243\M3-SPB: R20.2 U1.12 U1.13 U1.14 U1.15 U1.16 U1.17 U1.18 U1.19 U1.20 U20.12
$1I78243\M3-SPC: R7.2 U20.19 U56.12 U56.13 U56.14 U56.15 U56.16 U56.17 U56.18 U56.19 U56.20
ANG1-VCO: C88.1 R48.1 U2.M13
ANG1-VSI: C89.1 R49.1 U2.L12
ANG1-VTEM: C87.1 R47.1 U2.K10
ANG2-VCO: C91.1 R51.1 U2.K11
ANG2-VSI: C92.1 R52.1 U2.J12
ANG2-VTEM: C90.1 R50.1 U2.J11
ANG3-VCO: C94.1 R54.1 U2.J13
ANG3-VSI: C95.1 R55.1 U2.L13
ANG3-VTEM: C93.1 R53.1 U2.H13
BOOT_MODE0: R8.1 U2.G14 U25.1
BOOT_MODE1: R9.2 U2.F11 U26.1
CCM_CLK1_N: H7.20 U2.P13
CCM_CLK1_P: H7.18 U2.N13
ENC1A: R42.2 U2.B1 U81.3
ENC1B: R43.2 U2.A5 U81.4
ENC2A: R41.2 U2.F2 U79.3
ENC2B: R44.2 U2.C3 U79.4
ENC3A: R40.2 U2.E4 U80.3
ENC3B: R45.2 U2.E5 U80.4
ETH-LED1: R17.2 U17.4
ETH-LED2: R16.2 U17.2
ETH_CRS_DV: U2.C12 U17.20
ETH_INTR: U2.E11 U17.3
ETH_MDC: U2.C14 U17.16
ETH_MDIO: U2.B14 U17.15
ETH_RST_N: U2.E10 U17.5
ETH_RX_D0: U2.E12 U17.18
ETH_RX_D1: U2.D12 U17.17
ETH_RX_ER: U2.C13 U17.22
ETH_TX_D0: U2.B12 U17.23
ETH_TX_D1: U2.A12 U17.24
ETH_TX_EN: U2.A13 U17.1
ETH_XI: U2.B13 U17.13
GYRO-CS-1: U2.A6 U87.4
GYRO-CS-2: U2.A4 U88.4
GYRO-CS-3: U2.A3 U89.4
M1-HALL-A: R57.1 U2.E7
M1-HALL-B: R61.1 U2.E8
M1-HALL-C: R59.1 U2.D14
M1-INHA: U2.G2 U21.34
M1-INHB: U2.D2 U21.36
M1-INHC: U2.A2 U21.38
M1-INLA: U2.D3 U21.35
M1-INLB: U2.B3 U21.37
M1-INLC: U2.D1 U21.39
M1-SOA: U2.H12 U21.23
M1-SOB: U2.K14 U21.22
M1-SOC: U2.L14 U21.21
M1-SSCS: U2.B8 U21.29
M2-HALL-A: R63.1 U2.D13
M2-HALL-B: R67.1 U2.D8
M2-HALL-C: R65.1 U2.D9
M2-INHA: U2.H5 U12.34
M2-INHB: U2.H3 U12.36
M2-INHC: U2.G1 U12.38
M2-INLA: U2.H4 U12.35
M2-INLB: U2.C2 U12.37
M2-INLC: U2.G3 U12.39
M2-SOA: U2.H14 U12.23
M2-SOB: U2.L10 U12.22
M2-SOC: U2.G12 U12.21
M2-SSCS: U2.B9 U12.29
M3-HALL-A: R69.1 U2.C11
M3-HALL-B: R73.1 U2.C9
M3-HALL-C: R71.1 U2.C10
M3-INHA: U2.E1 U20.34
M3-INHB: U2.C5 U20.36
M3-INHC: U2.C4 U20.38
M3-INLA: U2.C6 U20.35
M3-INLB: U2.D5 U20.37
M3-INLC: U2.D4 U20.39
M3-SOA: U2.J14 U20.23
M3-SOB: U2.M14 U20.22
M3-SOC: U2.H11 U20.21
M3-SSCS: U2.A8 U20.29
MX-ENABLE: U2.A9 U12.30 U20.30 U21.30
MX-FAULT: U2.A10 U12.25 U20.25 U21.25
MX-MISO-SDO: R74.2 U2.G4 U12.26 U20.26 U21.26 U87.3 U88.3 U89.3
MX-MOSI-SDI: R75.2 U2.F4 U12.27 U20.27 U21.27 U87.5 U88.5 U89.5
MX-SCLK: R76.2 U2.E3 U12.28 U20.28 U21.28 U87.7 U88.7 U89.7
ONOFF: U2.M6 U28.1
PMIC_ON_REQ: R1.1 U2.K7 U23.3
POR_B: C32.1 R29.2 SW1.2 U2.M7
SD-CLK: U2.J3 U18.5
SD-CMD: R26.1 U2.J4 U18.3
SD-DAT0: R27.1 U2.J1 U18.7
SD-DAT1: R28.1 U2.K1 U18.8
SD-DAT2: R18.1 U2.H2 U18.1
SD-DAT3: R25.1 U2.J2 U18.2
SD_B1_01: U2.M5 U28.2
SD_B1_06: U2.L3 U19.1
SD_B1_07: U2.L4 U19.6
SD_B1_08: U2.P3 U19.5
SD_B1_09: U2.N4 U19.2
SD_B1_10: U2.P4 U19.3
SD_B1_11: U2.P5 U19.7
SPARE_I2C_SCL: H7.10 U2.P2
SPARE_I2C_SDA: H7.8 U2.N3
SPARE_IO-1_AD: H7.1 U2.K12
SPARE_IO-5: H7.9 U2.B2
SPARE_IO-6: H7.11 U2.B4
SPARE_IO-7: H7.13 U2.B6
SPARE_IO-8: H7.15 U2.C7
SPARE_IO-9: H7.17 U2.B7
SPARE_IO-10: H7.19 R78.1 R79.1 U2.A7
SPARE_IO-11: H7.6 U2.C1
SPARE_IO-14_AD: H7.12 U2.M12
SPARE_IO-15_AD: H7.14 U2.L11
UART_RX1: U2.G11 U82.2
UART_TX1: U2.M11 U82.4
USB_D+: U2.L8 USB1.3
USB_D-: U2.M8 USB1.2
USB_VBUS+5V_EXT: C27.2 U24.2 USB1.1
USB_VBUS+5V_INT: U2.N6
$1N3321: L9.1 U24.1
$1N5282: C31.2 U2.M10
$1N5709: R2.1 U18.9
$1N7252: C29.2 U2.K8
$1N9248: C34.1 U2.N11 X4.1
$1N9253: C35.1 R11.1 U2.P11 X4.2
$1N9641: C2.1 U2.P9 U66.2
$1N9645: C1.1 U2.N9 U66.1
$1N14387: R12.2 U2.K3
$1N14683: C36.2 C37.2 U2.P10
$1N14841: C38.2 C39.2 U2.P8
$1N15470: L4.1 U2.M1 U2.M2
$1N15653: C44.1 C45.1 C46.1 C47.1 L8.1 U2.L1 U2.L2
$1N17011: R13.2 U17.14
$1N19196: C53.2 U17.11
$1N19200: C51.2 U17.10
$1N19206: C52.2 U17.8
$1N19216: C54.2 U17.7
$1N19436: C53.1 RJ1.1
$1N19440: C51.1 RJ1.2
$1N19446: C52.1 RJ1.3
$1N19456: C54.1 RJ1.6
$1N19713: R17.1 RJ1.11
$1N23826: C64.1 L11.1 U55.6
$1N27405: L9.2 U77.2
$1N27515: C71.2 L7.1 U55.4 U55.5
$1N29938: D4.2 U47.1 U83.2
$1N33418: R19.2 R22.1 U55.3
$1N33422: R21.1 R22.2
$1N33492: C64.2 U55.1
$1N42129: Q1.3 U77.1
$1N42286: R16.1 RJ1.9
$1N65671: LED1.2 R46.2
$1N69624: H4.3 R56.1 R57.2
$1N69828: H4.5 R58.1 R59.2
$1N70032: H4.4 R60.1 R61.2
$1N70382: H5.5 R64.1 R65.2
$1N70388: H5.3 R62.1 R63.2
$1N70395: H5.4 R66.1 R67.2
$1N70758: H6.5 R70.1 R71.2
$1N70764: H6.3 R68.1 R69.2
$1N70771: H6.4 R72.1 R73.2
$1N70888: D4.1 U84.1
$1N70894: C58.2 L7.2 U84.2
$1N131056: LED3.2 R78.2 R79.2

Pads without a net: H3 9 12 13 17 20 21; H4 6; H5 6; H6 6; H7 7; NOREF#4 1; NOREF#8 1; NOREF#9 1; RJ1 4 5 7 8; SW1 1 3; U1 21 23 24 25 26; U2 A11 B11 C8 D6 D7 D10 D11 E14 F1 F3 F12 F13 F14 G5 G10 G13 H1 H10 L5 L6 L7 M3 M4 N7 N10 N12 P7; U12 31; U17 12; U19 9; U20 31; U21 31; U23 2 4; U32 21 23 24 25 26; U33 21 23 24 25 26; U34 21 23 24 25 26; U35 6 8; U50 21 23 24 25 26; U51 21 23 24 25 26; U52 21 23 24 25 26; U54 21 23 24 25 26; U56 21 23 24 25 26; U86 4 9 10 11; U87 6 8; U88 6 8; U89 6 8; U90 4 9 10 11; U91 6 8; U92 4 9 10 11; U93 6 8; USB1 4

## Via types
v1: diameter 0.6, hole 0.3, Top Layer to Bottom Layer, 147 vias
v2: diameter 0.4, hole 0.2, Top Layer to Bottom Layer, 277 vias

## Routing (per net, layer and track width the routed paths; a pad name or vN(x,y) marks a point on that pad's centre or on a via; arc(x,y) is an arc through that point)
3.3V: length 35.5
  Top Layer w0.127: R58.2 30.68,36.78 U25.2 ; v1(94.23,37.03) R74.1 R75.1 R76.1 ; 25.9,26.11 25.91,26.1 v1(25.91,25.02) ; 25.9,26.11 R62.2 ; 25.9,26.11 26.49,26.11 R64.2 ; R43.1 91.51,22.23 R42.1
  Top Layer w0.2: U17.19 v2(29.3,16.76)
  Top Layer w0.3: R2.2 80.73,17.65 v1(80.65,17.57) ; U18.4 88.31,16.47 87.79,16.98 C30.1 88.52,18.16 88.72,17.96 90.35,17.96 ; R18.2 v1(93.47,17.15) ; 89.28,18.03 v1(89.28,18.99) ; v1(23.62,19.56) 24.19,18.99 U17.6 ; v2(63.06,35.13) v2(62.26,34.33) ; v1(82.98,18.59) R28.2 R27.2
  Inner3 w0.3: v2(59.06,31.93) 57.04,31.93 56.83,32.13 53.85,32.13 53.21,32.77 v2(52.49,32.77)
  Inner3 w0.5: v2(57.47,38.33) 57.47,38.04 58.17,37.34 59.25,37.34 v2(59.87,36.73)
  vias: v2(31.62,15.58) v2(53.76,25.27) v2(57.28,43.14) v2(59.06,34.33) v2(59.06,23.53) v2(59.87,31.13) v2(62.26,31.13) v2(63.06,31.93) v2(63.87,35.13) v2(65.57,26.24) v2(69.94,35.43) v2(81.15,38.61) v2(82.68,38.77)
5.0V: length 21.3
  Top Layer w0.4: U2.P6 62.26,39.46 62.19,39.46
  Top Layer w0.6: C25.2 62.87,41.67 62.32,41.13 62.32,40.39 62.19,40.25 62.19,39.69 62.08,39.58 62.19,39.46
  Inner3 w0.6: v1(62.48,40.64) 61.34,40.64 60.45,39.75 55.5,39.75 54.86,40.39 52.71,40.39 51.94,39.62 v1(46.61,39.62)
  vias: v2(62.87,42.48)
GND: length 50.6
  Top Layer w0.127: U21.10 37.07,65.82 v2(37.39,66.14) ; v2(24.38,12.06) 24.89,12.57 R13.1 ; 31.75,66.29 31.91,66.13 U21.20 ; 34.42,68.86 34.54,68.73 36.12,68.73 36.73,68.12 36.73,66.45 36.41,66.13 U21.11 ; C93.2 C94.2 40.41,7.51 H3.22 ; U17.9 v2(25.81,17.66) U17.21 ; LED3.1 v1(62.1,10.03) ; H3.14 30.25,7.39 C91.2 C90.2 ; v1(45.59,6.1) 45.49,6.2 C95.2 ; C89.2 v1(26.16,7.64) ; C87.2 C88.2 20.47,5.39 H3.6
  Top Layer w0.3: v1(86.7,19.12) C30.2 86.7,17.36 86.11,16.76 86.11,15.21 U18.6
  Top Layer w0.4: 76.16,14.68 v1(77.52,14.68)
  Inner2 w0.127: v2(37.39,66.14) 39.22,66.14 41.4,68.33 v2(41.4,70.97) ; v2(25.76,70.97) 26.97,70.97 v2(31.65,66.29) ; v2(34.14,71.02) 34.14,69.19 v2(34.39,68.94)
  vias: v1(17.47,69.9) v1(18.49,69.9) v1(19.51,69.9) v1(20.52,69.9) v1(21.54,69.9) v1(22.56,69.9) v1(86.11,16.66) v2(25.15,18.29) v2(25.15,17.02) v2(26.42,18.29) v2(26.42,17.02) v2(30.39,16.76) v2(30.39,15.75) v2(31.62,16.63) v2(33.11,15.25) v2(33.4,20.7) v2(34.04,14.48) v2(34.16,19.81) v2(46.5,14.21) v2(46.72,19.92) v2(50.76,36.83) v2(51.4,32.77) v2(51.55,45.79) v2(52.67,25.27) v2(53,45.79) v2(53.26,50.8) v2(53.26,49.16) v2(54.53,49.11) v2(55.87,38.33) v2(55.87,27.93) v2(56.66,35.13) v2(56.66,31.13) v2(57.28,44.23) v2(58.71,43.89) v2(59.06,28.73) v2(59.06,22.44) v2(59.87,35.93) v2(59.87,35.13) v2(60.71,45.3) v2(60.71,43.85) v2(60.66,37.53) v2(60.66,34.33) v2(60.66,33.53) v2(60.66,32.73) v2(61.38,24) v2(61.38,22.99) v2(61.47,34.33) v2(61.47,33.53) v2(61.47,32.73) v2(62.26,35.13) v2(62.87,43.47) v2(63.06,37.53) v2(63.06,28.73) v2(65.47,37.53) v2(65.47,35.13) v2(65.47,31.13) v2(66.26,38.33) v2(66.26,37.53) v2(66.26,27.93) v2(66.66,26.24) v2(68.64,34.67) v2(68.64,33.91) v2(71.03,37.59) v2(71.03,35.43) v2(71.92,45.08) v2(71.92,44.07) v2(72.26,34.67) v2(72.26,33.91) v2(73.53,32.64) v2(73.53,27.18) v2(74.54,34.67) v2(74.54,33.91) v2(74.55,32.64) v2(74.55,27.18) v2(75.03,38.87) v2(76.17,38.87) v2(77.31,38.87) v2(77.34,34.67) v2(77.34,33.91) v2(80.39,34.67) v2(80.39,33.91) v2(81.08,35.69) v2(82.68,37.68) v2(83.44,34.67) v2(83.44,33.91) v2(85.63,39.37) v2(86.49,34.67) v2(86.49,33.91) v2(86.74,32) v2(86.74,29.21) v2(86.74,26.42) v2(86.74,23.62) v2(86.74,20.71) v2(87.63,32) v2(87.63,29.21) v2(87.63,26.42) v2(87.63,23.62) v2(87.63,20.71) v2(87.76,34.67) v2(87.76,33.91)
VDD_SOC_IN: length 10.1
  Top Layer w0.25: v2(62.26,32.73) v2(62.26,31.93) v2(61.47,31.93) v2(60.66,31.93) U2.F9 U2.G9
  Top Layer w0.5: U2.J9 U2.H9 U2.G9 ; U2.J5 U2.H6 v2(62.26,32.73)
  Top Layer w0.8: v2(70.83,45.08) 70.87,45.05 L4.2
  vias: v2(60.29,24) v2(60.29,22.99) v2(70.83,44.07)
VDDA_ADC_3P3: length 53.5
  Top Layer w0.127: v2(54.91,44.25) 55.02,44.14 55.02,42.37 55.37,42.01 55.37,38.02 U2.N14
  Inner3 w0.127: v2(54.91,44.25) 56.53,44.25 57.09,44.81 63.35,44.81 65.07,43.08 98.65,43.08 99.87,44.3
(no net): length 1.2
  Top Layer w0.127: U17.12 23.77,15.62 v1(23.62,15.62)
$1I69294\A1-VCO: length 6
  Top Layer w0.127: H3.3 18.92,3.84 18.92,7.31 R48.2
$1I69294\A1-VSI: length 5.6
  Top Layer w0.127: 22.63,2.47 23.9,3.74 R49.2
$1I69294\A1-VTEM: length 2.5
  Top Layer w0.127: 22.63,5.01 R47.2
$1I69294\A2-VCO: length 5.5
  Top Layer w0.127: 29.24,7.37 28.83,6.96 28.83,3.59 27.71,2.47
$1I69294\A2-VSI: length 5.4
  Top Layer w0.127: 33.94,7.37 33.94,3.61 H3.15
$1I69294\A2-VTEM: length 2.4
  Top Layer w0.127: H3.16 32.79,7.37
$1I69294\A3-VCO: length 5.7
  Top Layer w0.127: R54.2 39.12,7.22 39.12,3.71 H3.19
$1I69294\A3-VSI: length 5.6
  Top Layer w0.127: R55.2 44.32,7.4 44.32,3.84 H3.23
$1I69294\A3-VTEM: length 2.6
  Top Layer w0.127: H3.24 42.95,7.54 R53.2
$1I78243\M1-GHA: length 3.8
  Top Layer w0.25: U21.6 v1(39.47,62.63) ; U32.1 44.58,84.97 44.62,84.97 44.93,85.28 44.99,85.28 v1(45.16,85.45)
$1I78243\M1-GHB: length 23.3
  Top Layer w0.25: v1(37.11,85.45) 36.94,85.28 36.92,85.28 36.62,84.97 36.58,84.97 U33.1 ; U21.15 v1(34.41,66.75)
  Inner2 w0.3: v1(37.11,85.45) 37.14,85.42 37.14,78.49 36.37,77.72 36.37,67.61 35.51,66.75 v1(34.41,66.75)
$1I78243\M1-GHC: length 24.3
  Top Layer w0.25: v1(33.94,67.84) 33.91,67.81 33.91,67 33.89,66.97 33.89,66.53 33.91,66.51 U21.16 ; U34.1 28.83,84.93 29.13,85.23 29.13,85.26 v1(29.31,85.45)
  Inner2 w0.3: v1(29.31,85.45) 29.15,85.29 29.15,85.22 29.05,85.12 29.05,79.77 29.15,79.68 29.15,79.08 29.4,78.83 29.4,78.04 29.25,77.89 29.25,72.09 33.48,67.87 34.07,67.87 34.04,67.84 v1(33.94,67.84)
$1I78243\M1-GLA: length 2.7
  Top Layer w0.25: v1(44.2,78.44) 44.2,78.51 44.58,78.9 U32.22 ; v1(38.35,63.66) 38.32,63.63 U21.8
$1I78243\M1-GLB: length 14.8
  Top Layer w0.25: U33.22 36.58,78.9 36.19,78.51 v1(36.19,78.44) ; v1(35.8,67.86) 35.8,66.59 35.41,66.2 U21.13
  Inner2 w0.3: v1(36.19,78.44) 35.8,78.04 v1(35.8,67.86)
$1I78243\M1-GLC: length 16.4
  Top Layer w0.25: v1(32.83,66.76) 32.91,66.68 U21.18 ; v1(28.45,78.44) 28.45,78.51 28.83,78.9 U34.22
  Inner2 w0.3: v1(32.83,66.76) 32.83,67.26 28.6,71.49 28.6,71.58 28.45,71.73 v1(28.45,78.44)
$1I78243\M1-SHA: length 3.1
  Top Layer w0.25: v1(44.4,85.5) 44.08,85.18 U32.2 ; U21.7 38.89,63.13 v1(38.91,63.16)
$1I78243\M1-SHB: length 22.2
  Top Layer w0.25: v1(36.36,85.5) 36.08,85.22 U33.2 ; U21.14 34.91,66.36 35.1,66.55 v1(35.1,67.36)
  Inner2 w0.3: v1(36.36,85.5) 36.55,85.3 36.55,79.63 35.25,78.33 35.25,68.1 35.25,68.09 35.25,67.64 35.25,67.63 35.25,67.51 v1(35.1,67.36)
$1I78243\M1-SHC: length 23.5
  Top Layer w0.25: U21.17 33.41,67.24 v1(33.39,67.27) ; v1(28.56,85.45) 28.33,85.22 U34.2
  Inner2 w0.3: v1(33.39,67.27) 29,71.65 29,71.74 28.85,71.9 28.85,78.06 29,78.21 29,78.66 28.75,78.92 28.75,79.51 28.56,79.69 v1(28.56,85.45)
$1I78243\M1-SPA: length 15.6
  Top Layer w0.25: U21.9 37.76,64.13 v1(37.84,64.22)
  Inner2 w0.127: v2(41.35,77.11) 41.91,76.56 41.91,68.28 v1(37.84,64.22)
$1I78243\M1-SPB: length 14.8
  Top Layer w0.127: U21.12 35.91,66.09 36.47,66.65 36.47,67.85 35.9,68.43 34.29,68.43 34.04,68.68 v2(33.38,68.68)
  Inner2 w0.127: v2(33.38,68.68) 33.66,68.96 v2(33.66,77.11)
$1I78243\M1-SPC: length 14.6
  Top Layer w0.127: v2(32.11,66.65) 32.41,66.34 U21.19
  Inner2 w0.127: v2(32.11,66.65) 27.19,71.56 27.19,71.71 25.78,73.13 v2(25.78,77.11)
$1I78243\M2-GHA: length 1.4
  Top Layer w0.25: U50.1 79.25,84.97 79.29,84.97 79.6,85.28 79.66,85.28 v1(79.83,85.45)
$1I78243\M2-GHB: length 2.9
  Top Layer w0.25: U12.15 v1(68.72,66.75) ; v1(71.87,85.5) 71.65,85.28 71.65,85.28 71.34,84.97 71.25,84.97 U51.1
$1I78243\M2-GHC: length 4
  Top Layer w0.25: U52.1 63.5,84.98 63.8,85.28 63.81,85.28 v1(64.03,85.5) ; v1(68.25,67.84) 68.23,67.81 68.23,67 68.2,66.97 68.2,66.53 68.23,66.51 68.23,65.29
$1I78243\M2-GLA: length 1.4
  Top Layer w0.25: v1(78.87,78.44) 78.87,78.51 79.25,78.9 U50.22
$1I78243\M2-GLB: length 4.1
  Top Layer w0.25: v1(70.08,67.87) 70.08,66.55 69.72,66.2 U12.13 ; v1(70.87,78.44) 70.87,78.51 71.25,78.9 U51.22
$1I78243\M2-GLC: length 2.9
  Top Layer w0.25: 67.23,65.29 67.23,66.68 v1(67.14,66.76) ; U52.22 63.5,78.9 63.12,78.51 v1(63.12,78.44)
$1I78243\M2-SHA: length 1.3
  Top Layer w0.25: v1(79.07,85.5) 78.75,85.18 U50.2
$1I78243\M2-SHB: length 3.4
  Top Layer w0.25: U51.2 70.75,85.13 v1(71.12,85.5) ; U12.14 69.22,66.36 69.41,66.55 v1(69.41,67.36)
$1I78243\M2-SHC: length 3.2
  Top Layer w0.25: v1(67.7,67.27) 67.72,67.24 U12.17 ; v1(63.27,85.5) 63,85.23 U52.2
$1I78243\M3-GHA: length 1.3
  Top Layer w0.25: U54.1 112.02,84.92 112.05,84.92 112.36,85.23 112.43,85.23 v1(112.6,85.39)
$1I78243\M3-GHB: length 2.7
  Top Layer w0.25: v1(104.55,85.34) 104.43,85.23 104.31,85.23 104.02,84.93 U1.1 ; U20.15 v1(101.75,66.75)
$1I78243\M3-GHC: length 3.8
  Top Layer w0.25: v1(101.27,67.84) 101.25,67.81 101.25,67 101.22,66.97 101.22,66.53 101.25,66.51 101.25,65.29 ; U56.1 96.27,84.83 96.56,85.13 96.56,85.16 v1(96.75,85.34)
$1I78243\M3-GLA: length 1.4
  Top Layer w0.25: U54.22 112.02,78.9 111.63,78.51 v1(111.63,78.44)
$1I78243\M3-GLB: length 4.1
  Top Layer w0.25: U20.13 102.75,66.2 103.1,66.55 v1(103.1,67.87) ; U1.22 104.02,78.9 103.63,78.51 v1(103.63,78.44)
$1I78243\M3-GLC: length 2.9
  Top Layer w0.25: 100.25,65.29 100.25,66.68 v1(100.16,66.76) ; U56.22 96.27,78.9 95.88,78.51 v1(95.88,78.44)
$1I78243\M3-SHA: length 1.2
  Top Layer w0.25: U54.2 111.52,85.13 v1(111.84,85.45)
$1I78243\M3-SHB: length 3.4
  Top Layer w0.25: U1.2 103.52,85.18 v1(103.78,85.45) ; U20.14 102.25,66.36 102.44,66.55 v1(102.44,67.36)
$1I78243\M3-SHC: length 3.1
  Top Layer w0.25: v1(100.72,67.27) 100.75,67.24 U20.17 ; v1(96,85.34) 95.77,85.12 U56.2
ANG1-VCO: length 69
  Top Layer w0.127: U2.M13 56.54,36.73 56.13,36.32 53.34,36.32 52.73,36.93 51.18,36.93 50.91,37.2 39.84,37.2 39.58,36.93 38.25,36.93 36.42,38.76 30.33,38.76 v2(29.57,38) ; C88.1 20.03,8.86 19.74,8.56 R48.1 19.46,8.71 v2(19.46,9.35)
  Inner2 w0.127: v2(29.57,38) 29.57,18.34 28.8,17.58 28.8,9.75 v1(28.4,9.35)
  Inner3 w0.127: v1(28.4,9.35) v2(19.46,9.35)
ANG1-VSI: length 61.2
  Top Layer w0.127: v1(25.27,11.81) 25.27,8.83 C89.1 25.14,8.76 24.77,8.76 24.37,8.36 R49.1
  Inner2 w0.127: v1(40.55,12.19) 40.55,12.64 40.61,12.71 40.61,12.81 40.67,12.86 40.67,36.24 v1(40.89,36.47)
  Inner3 w0.127: v1(25.27,11.81) 25.65,12.19 v1(40.55,12.19) ; v1(40.89,36.47) 52.56,36.47 52.71,36.32 57.07,36.32 v2(57.47,35.93)
ANG1-VTEM: length 63.5
  Top Layer w0.127: v1(24.49,10.77) 24.49,10.21 23.72,9.45 23.72,9.45 R47.1 22.49,8.51 22.1,8.51 21.75,8.86 C87.1 ; U2.K10 58.61,34.67 58.44,34.67 58.42,34.69 55.71,34.69 55.69,34.67 53.49,34.67 53.36,34.79 53.06,34.79 52.94,34.67 42.49,34.67 42.01,35.15 37.8,35.15 v1(37.39,34.75)
  Inner2 w0.127: v1(37.39,34.75) v1(37.39,11.28)
  Inner3 w0.127: v1(24.49,10.77) 24.99,11.28 v1(37.39,11.28)
ANG2-VCO: length 55
  Top Layer w0.127: v2(40.69,10.31) 30.78,10.31 30.38,9.91 30.38,9.58 ; R51.1 29.57,8.24 29.94,8.6 30.38,8.6 30.38,9.57
  Inner2 w0.127: v2(40.69,10.31) 40.94,10.57 40.94,11.93 41.01,12 41.01,12.38 40.94,12.45 40.94,12.7 40.9,12.75 40.9,34.16 v1(41.4,34.67)
  Inner3 w0.127: v2(58.26,35.13) 57.81,34.67 57.64,34.67 57.62,34.69 57.27,34.69 57.25,34.72 53.44,34.72 53.36,34.79 53.06,34.79 52.94,34.67 v1(41.4,34.67)
ANG2-VSI: length 47.9
  Top Layer w0.127: v2(41.15,9.5) 37.8,9.5 36.9,8.6 34.91,8.6 34.54,8.24 R52.1
  Inner2 w0.127: v2(41.15,9.5) 41.36,9.71 v1(41.36,32.89)
  Inner3 w0.127: v1(41.36,32.89) 42.25,33.78 44.08,33.78 44.29,33.99 45.26,33.99 45.34,34.06 53.49,34.06 53.76,34.33 v2(57.47,34.33)
ANG2-VTEM: length 51.6
  Top Layer w0.127: 31.52,8.6 31.91,8.6 32.28,8.24 R50.1 32.79,9.22 33.58,10.01 40.48,10.01 40.54,9.95 40.84,9.95 40.9,10.01 42.11,10.01 v2(42.16,10.06)
  Inner2 w0.127: v2(42.16,10.06) 42.16,25.09 42.33,25.26 v1(42.33,32.81)
  Inner3 w0.127: v1(42.33,32.81) 43.05,33.53 44.15,33.53 44.38,33.76 45.36,33.76 45.44,33.83 53.65,33.83 53.72,33.91 57.85,33.91 v2(58.26,34.33)
ANG3-VCO: length 44.1
  Top Layer w0.127: R54.1 39.99,8.36 40.35,8.73 C94.1 ; v1(40.15,34.1) 41.02,34.1 41.21,33.91 56.25,33.91 U2.J13
  Inner2 w0.127: v1(40.15,34.1) 40.44,33.81 40.44,12.95 40.08,12.6 40.08,8.48 v2(39.98,8.38)
ANG3-VSI: length 4.2
  Top Layer w0.127: 45.49,8.6 45.25,8.36 R55.1 ; 53.97,35.56 56.3,35.56 U2.L13
ANG3-VTEM: length 39.9
  Top Layer w0.127: C93.1 42.07,8.73 42.42,8.38 42.99,8.38 42.99,8.38 42.99,9.85 v1(43.43,10.29)
  Inner2 w0.127: v1(43.43,10.29) 43.81,10.67 43.81,23.36 43.62,23.56 43.62,23.94 43.76,24.07 v1(43.76,32.81)
  Inner3 w0.127: v1(43.76,32.81) 44.48,33.53 45.45,33.53 45.53,33.61 53.66,33.61 54.11,33.15 56.29,33.15 v2(56.66,33.53)
BOOT_MODE0: length 25.3
  Top Layer w0.127: U25.1 34.22,36.65 R8.1 35.87,36.7 36.32,36.7 37.16,35.86 37.16,35.18 36.92,34.94 36.92,34.55 37.2,34.28 37.98,34.28 38.99,33.27 39.37,33.27 39.5,33.4 53.09,33.4 53.76,32.73 U2.G14
BOOT_MODE1: length 7
  Top Layer w0.127: U2.F11 57.81,32.39 57.64,32.39 57.62,32.36 55.71,32.36 55.69,32.39 53.72,32.39 ; U26.1 33.83,34.36 R9.2
CCM_CLK1_N: length 48.4
  Top Layer w0.127: U2.P13 56.66,41.19 v2(55.74,42.11)
  Inner3 w0.127: v2(55.74,42.11) 99.11,42.11 99.72,42.72
CCM_CLK1_P: length 55.3
  Top Layer w0.127: v2(55.37,45.77) 55.37,42.93 55.82,42.48 55.89,42.48 57.02,41.34 57.02,38.48 57.03,38.48 57.03,37.89 U2.N13
  Inner3 w0.127: 99.77,48.79 99.77,48.79 99.71,48.74 92.16,48.74 92.11,48.79 67.2,48.79 67.15,48.84 59.19,48.84 58.96,48.62 57.4,48.62 55.37,46.58 v2(55.37,45.77)
ENC1A: length 31.7
  Top Layer w0.127: U2.B1 70.64,28.73 70.87,28.5 81.53,28.5 81.73,28.3 81.83,28.3 82.1,28.03 82.1,27.93 85.95,24.08 88.19,24.08 88.85,23.42 91.85,23.42 92.35,22.92 R42.2 94.55,22.26 U81.3
ENC1B: length 41.8
  Top Layer w0.127: U2.A5 63.06,27.26 63.25,27.08 63.25,25.3 63.75,24.79 v1(63.75,21.07) ; U81.4 93.19,21.08 R43.2
  Inner3 w0.127: v1(63.75,21.07) 93.19,21.07 U81.4
ENC2A: length 31.5
  Top Layer w0.127: U79.3 94.7,27.85 91.97,27.85 91.85,27.97 91.85,28.7 91.08,29.46 88.65,29.46 87.25,30.86 75.34,30.86 75.25,30.95 74.86,30.95 74.77,30.86 70.36,30.86 69.72,31.5 65.9,31.5 U2.F2
ENC2B: length 31.9
  Top Layer w0.127: U2.C3 65.03,29.16 68.02,29.16 68.23,28.96 86.33,28.96 87.4,27.89 89.46,27.89 91.97,25.38 91.97,25.31 94.7,25.31 U79.4
ENC3A: length 26.6
  Inner3 w0.127: v2(63.87,31.13) 64.26,30.73 74.32,30.73 74.47,30.89 74.8,30.89 74.86,30.95 75.25,30.95 75.32,30.89 88.84,30.89 88.85,30.88 89.15,30.88 89.16,30.89 90.17,30.89
ENC3B: length 27.3
  Inner3 w0.127: 90.17,31.55 89.21,31.55 89.15,31.61 88.85,31.61 88.79,31.55 63.49,31.55 v2(63.06,31.13)
ETH-LED1: length 10
  Top Layer w0.127: U17.4 25.31,20.61 25.4,20.7 25.4,21.59 25.15,21.84 18.21,21.84 R17.2
ETH-LED2: length 18.4
  Top Layer w0.127: R16.2 23.35,10.29 v1(23.73,10.67) ; U17.2 26.31,20.09 v1(26.42,20.19)
  Inner2 w0.127: v1(26.42,20.19) 26.16,19.94 24.77,19.94 24.38,19.56 24.38,12.95 23.73,12.3 v1(23.73,10.67)
ETH_CRS_DV: length 38.2
  Top Layer w0.127: v2(47.9,19.43) 47.9,19.96 52.07,24.13 52.07,25.58 52.65,26.16 55.25,26.16 56.19,27.1 56.36,27.1 57.03,27.77 57.03,29.09 U2.C12 ; v2(47.28,17.78) 46.65,17.15 34.29,17.15 33.88,17.55 28.35,17.55 27.96,17.16 U17.20
  Inner2 w0.127: v2(47.9,19.43) 47.9,18.39 v2(47.28,17.78)
ETH_INTR: length 38.5
  Top Layer w0.127: U17.3 25.81,20.48 27.18,21.84 41.15,21.84 44.2,24.89 47.37,24.89 53.97,31.5 57.9,31.5 U2.E11
ETH_MDC: length 41.8
  Top Layer w0.127: v1(52.2,20.19) 49.66,17.65 48.13,17.65 48.11,17.63 47.78,17.63 43.49,13.34 28.83,13.34 26.31,15.85 U17.16 ; U2.C14 55.56,29.53 55.37,29.34 54.36,29.34 v2(52.32,27.31)
  Inner2 w0.127: v1(52.2,20.19) 52.2,27.18 v2(52.32,27.31)
ETH_MDIO: length 41.6
  Top Layer w0.127: U17.15 25.81,15.97 28.7,13.08 43.56,13.08 47.88,17.4 50.29,17.4 v2(54.48,21.59) ; v2(54.61,27.81) 55.52,28.73 U2.B14
  Inner2 w0.127: v2(54.48,21.59) 54.61,21.72 v2(54.61,27.81)
ETH_RST_N: length 44.3
  Top Layer w0.127: U17.5 24.91,21.19 v1(24.89,21.21) ; U2.E10 58.67,30.74 58.67,26.8 57.15,25.27 v2(57.15,22.61)
  Inner3 w0.127: v1(24.89,21.21) 25.15,21.46 42.93,21.46 43.56,22.1 56.64,22.1 v2(57.15,22.61)
ETH_RX_D0: length 41.5
  Top Layer w0.127: v2(33.91,15.03) 33.4,15.03 33.26,14.89 32.96,14.89 32.86,14.99 28.49,14.99 U17.18 ; U2.E12 57.47,30.73 57.42,30.69 57.31,30.69 57.23,30.61 56.91,30.61 56.82,30.7 56.51,30.7 56.42,30.61 56.11,30.61 56.02,30.7 55.71,30.7 55.5,30.49 55.5,30.34 55.23,30.07 53.9,30.07 44.22,20.39 34.42,20.39 34.41,20.41 34.12,20.41 v2(33.99,20.54)
  Inner2 w0.127: 33.99,20.54 33.78,20.34 33.78,15.16 v2(33.91,15.03)
ETH_RX_D1: length 41.5
  Top Layer w0.127: v2(33.4,14.48) 33.22,14.66 32.86,14.66 32.79,14.73 28.21,14.73 U17.17 ; v2(33.42,20.09) 33.48,20.15 33.99,20.15 34.01,20.18 34.31,20.18 34.34,20.15 39.92,20.15 39.93,20.16 44.31,20.16 54,29.84 55.57,29.84 55.69,29.96 56.02,29.96 56.07,30.02 56.46,30.02 56.51,29.96 56.82,29.96 56.87,30.02 56.94,30.02 56.99,29.97 57.11,29.97 U2.D12
  Inner2 w0.127: v2(33.4,14.48) 33.42,14.49 33.42,15.04 33.47,15.1 33.47,15.4 33.42,15.46 v2(33.42,20.09)
